# EAGLE design AW32_Demoboard_V11_DLN_18319 (EAGLE 5.11)

## Sheet 1 of 3
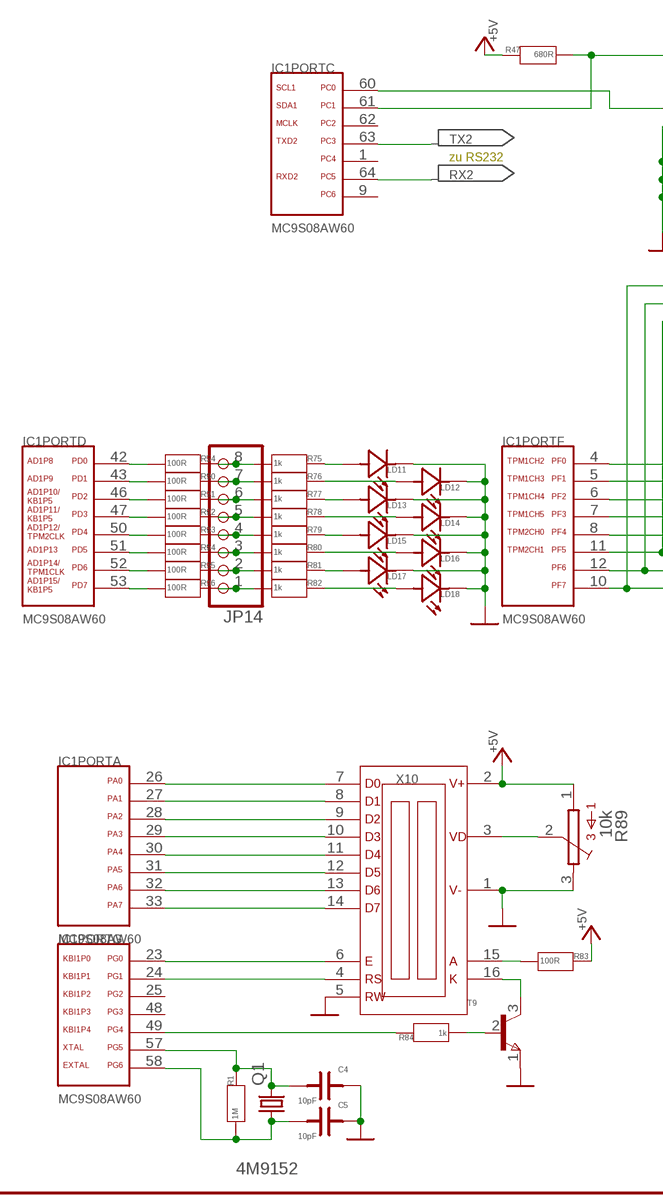
[diagram p0: schematic, sheet 1, part 1 of 2]
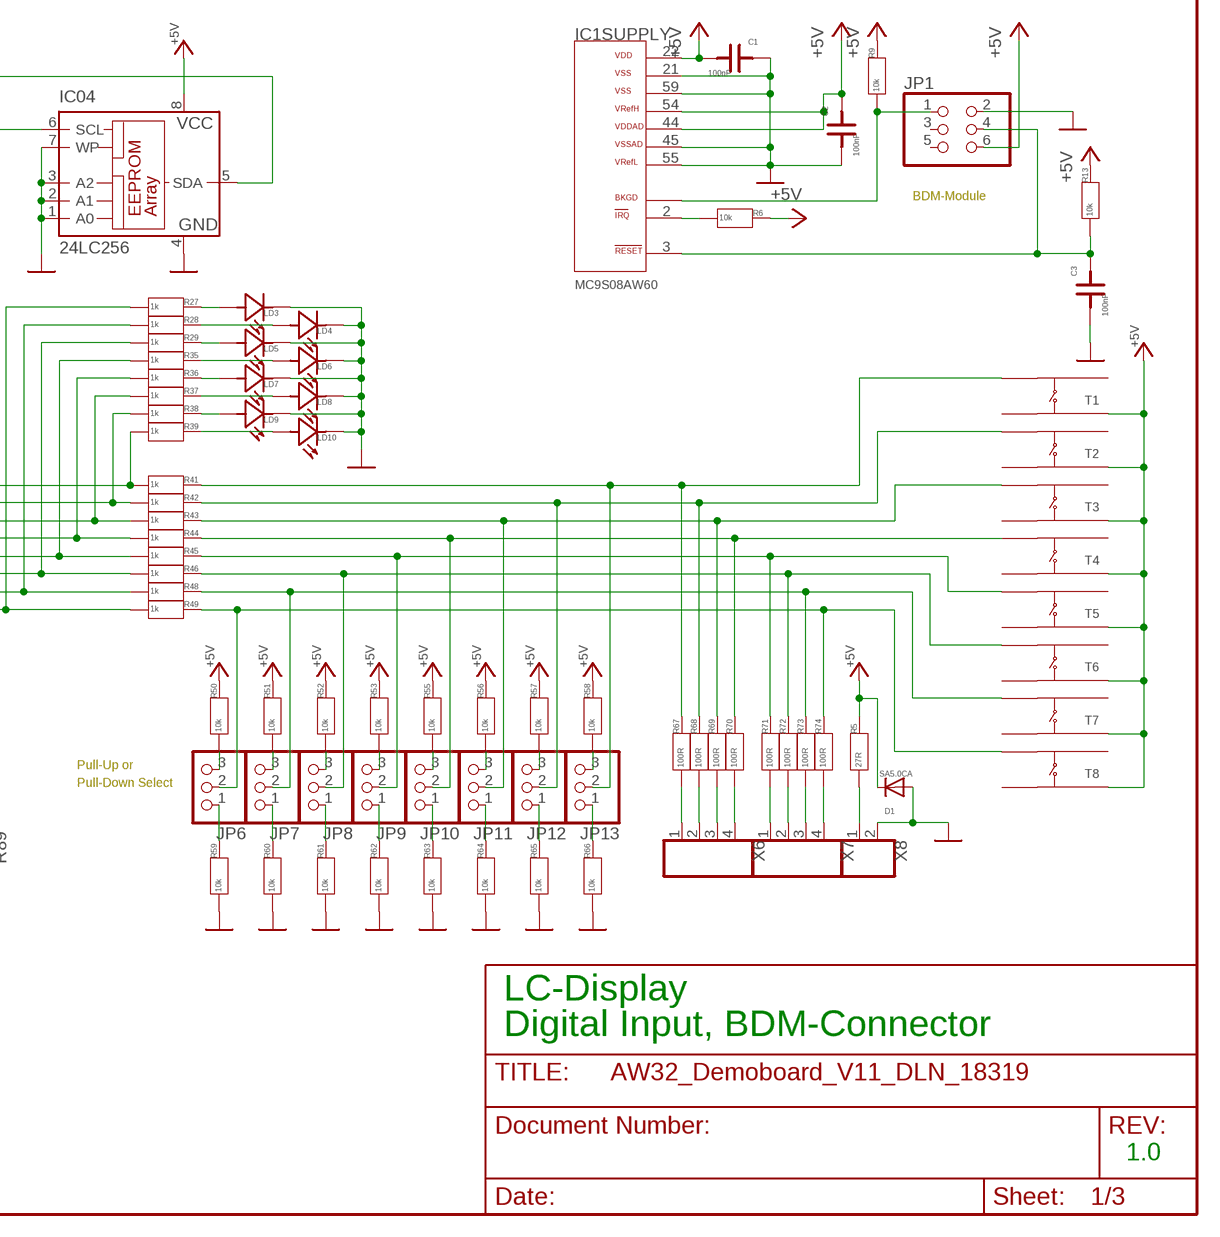
[diagram p1: schematic, sheet 1, part 2 of 2]

### Parts
C1  100nF  C1  [0805F]
C2  100nF  C1  [0805F]
C3  100nF  C1  [0805F]
C4  10pF  C1  [0805F]
C5  10pF  C1  [0805F]
D1  SA5.0CA  DIODE-SMB  [SMB]
IC1  MC9S08AW60  [LQFP64]
IC04  24LC256  24CLC256SM  [SO-08M]
JP1  PINHD-2X3  [2X03]
JP6  PINHD-1X3  [1X03]
JP7  PINHD-1X3  [1X03]
JP8  PINHD-1X3  [1X03]
JP9  PINHD-1X3  [1X03]
JP10  PINHD-1X3  [1X03]
JP11  PINHD-1X3  [1X03]
JP12  PINHD-1X3  [1X03]
JP13  PINHD-1X3  [1X03]
JP14  PINHD-1X8  [1X08]
LD3  LEDSMD  [0805LED]
LD4  LEDSMD  [0805LED]
LD5  LEDSMD  [0805LED]
LD6  LEDSMD  [0805LED]
LD7  LEDSMD  [0805LED]
LD8  LEDSMD  [0805LED]
LD9  LEDSMD  [0805LED]
LD10  LEDSMD  [0805LED]
LD11  LEDSMD  [0805LED]
LD12  LEDSMD  [0805LED]
LD13  LEDSMD  [0805LED]
LD14  LEDSMD  [0805LED]
LD15  LEDSMD  [0805LED]
LD16  LEDSMD  [0805LED]
LD17  LEDSMD  [0805LED]
LD18  LEDSMD  [0805LED]
Q1  4M9152  HC49UP  [HC49UP]
R1  1M  R1  [0805]
R5  27R  R1  [0805]
R6  10k  R1  [0805]
R9  10k  R1  [0805]
R13  10k  R1  [0805]
R27  1k  R1  [0805]
R28  1k  R1  [0805]
R29  1k  R1  [0805]
R35  1k  R1  [0805]
R36  1k  R1  [0805]
R37  1k  R1  [0805]
R38  1k  R1  [0805]
R39  1k  R1  [0805]
R41  1k  R1  [0805]
R42  1k  R1  [0805]
R43  1k  R1  [0805]
R44  1k  R1  [0805]
R45  1k  R1  [0805]
R46  1k  R1  [0805]
R47  680R  R1  [0805]
R48  1k  R1  [0805]
R49  1k  R1  [0805]
R50  10k  R1  [0805]
R51  10k  R1  [0805]
R52  10k  R1  [0805]
R53  10k  R1  [0805]
R54  100R  R1  [0805]
R55  10k  R1  [0805]
R56  10k  R1  [0805]
R57  10k  R1  [0805]
R58  10k  R1  [0805]
R59  10k  R1  [0805]
R60  10k  R1  [0805]
R61  10k  R1  [0805]
R62  10k  R1  [0805]
R63  10k  R1  [0805]
R64  10k  R1  [0805]
R65  10k  R1  [0805]
R66  10k  R1  [0805]
R67  100R  R1  [0805]
R68  100R  R1  [0805]
R69  100R  R1  [0805]
R70  100R  R1  [0805]
R71  100R  R1  [0805]
R72  100R  R1  [0805]
R73  100R  R1  [0805]
R74  100R  R1  [0805]
R75  1k  R1  [0805]
R76  1k  R1  [0805]
R77  1k  R1  [0805]
R78  1k  R1  [0805]
R79  1k  R1  [0805]
R80  1k  R1  [0805]
R81  1k  R1  [0805]
R82  1k  R1  [0805]
R83  100R  R1  [0805]
R84  1k  R1  [0805]
R89  10k  S63X  [S63X]
R90  100R  R1  [0805]
R91  100R  R1  [0805]
R92  100R  R1  [0805]
R93  100R  R1  [0805]
R94  100R  R1  [0805]
R95  100R  R1  [0805]
R96  100R  R1  [0805]
T1  TASTERTHT  [TASTE_THT]
T2  TASTERTHT  [TASTE_THT]
T3  TASTERTHT  [TASTE_THT]
T4  TASTERTHT  [TASTE_THT]
T5  TASTERTHT  [TASTE_THT]
T6  TASTERTHT  [TASTE_THT]
T7  TASTERTHT  [TASTE_THT]
T8  TASTERTHT  [TASTE_THT]
T9  BC817  [SOT-23]
X6  KLEMME4  [KLEMME4]
X7  KLEMME4  [KLEMME4]
X8  KLEMME2  [KLEMME2]
X10  FDCC1602E  [FDCC1602E]

### Nets
+5V: C1.1 C2.2 D1.C IC1.22(SUPPLY:VDD) IC1.44(SUPPLY:VDDAD) IC1.54(SUPPLY:VREFH) IC04.8(VCC) JP1.6 R5.2 R6.2 R9.2 R13.2 R47.2 R50.2 R51.2 R52.2 R53.2 R55.2 R56.2 R57.2 R58.2 R83.2 R89.1 T1.A1 T2.A1 T3.A1 T4.A1 T5.A1 T6.A1 T7.A1 T8.A1 X10.2(V+) ; also sheet 2,3
BKGD: IC1.56(SUPPLY:BKGD) JP1.1 R9.1
D0: IC1.26(PORTA:PA0) X10.7(D0)
D1: IC1.27(PORTA:PA1) X10.8(D1)
D2: IC1.28(PORTA:PA2) X10.9(D2)
D3: IC1.29(PORTA:PA3) X10.10(D3)
GND: C1.2 C2.1 C3.1 C4.2 C5.2 D1.A IC1.21(SUPPLY:VSS) IC1.45(SUPPLY:VSSAD) IC1.55(SUPPLY:VREFL) IC1.59(SUPPLY:VSS2) IC04.1(A0) IC04.2(A1) IC04.3(A2) IC04.4(GND) IC04.7(WP) JP1.2 LD3.K LD4.K LD5.K LD6.K LD7.K LD8.K LD9.K LD10.K LD11.K LD12.K LD13.K LD14.K LD15.K LD16.K LD17.K LD18.K R59.1 R60.1 R61.1 R62.1 R63.1 R64.1 R65.1 R66.1 R89.3 T9.1(E) X8.2 X10.1(V-) X10.5(RW) ; also sheet 2,3
IRQ: IC1.2(SUPPLY:IRQ/) R6.1
LCD_LED: IC1.49(PORTG:PG4) R84.2
N$4: IC1.42(PORTD:PD0) R54.1
N$8: IC1.43(PORTD:PD1) R90.1
N$9: IC1.46(PORTD:PD2) R91.1
N$10: IC1.47(PORTD:PD3) R92.1
N$11: JP13.3 R58.1
N$12: JP12.3 R57.1
N$13: JP11.2 R43.2 R69.2 T3.B2
N$14: LD11.A R75.2
N$15: LD12.A R76.2
N$16: C4.1 IC1.57(PORTG:PG5) Q1.2 R1.2
N$17: IC1.50(PORTD:PD4) R93.1
N$18: IC1.51(PORTD:PD5) R94.1
N$19: IC1.52(PORTD:PD6) R95.1
N$20: IC1.53(PORTD:PD7) R96.1
N$21: IC1.12(PORTF:PF6) R28.1 R48.1
N$22: C5.1 IC1.58(PORTG:PG6) Q1.1 R1.1
N$23: IC1.11(PORTF:PF5) R29.1 R46.1
N$24: LD3.A R27.2
N$25: LD4.A R28.2
N$26: LD5.A R29.2
N$27: LD6.A R35.2
N$29: LD7.A R36.2
N$31: LD8.A R37.2
N$32: LD9.A R38.2
N$33: LD10.A R39.2
N$34: JP11.3 R56.1
N$35: JP9.2 R45.2 R71.2 T5.B2
N$36: JP8.2 R46.2 R72.2 T6.B2
N$37: JP7.2 R48.2 R73.2 T7.B2
N$38: JP10.3 R55.1
N$39: JP9.3 R53.1
N$40: JP8.3 R52.1
N$41: JP7.3 R51.1
N$42: IC1.10(PORTF:PF7) R27.1 R49.1
N$43: R5.1 X8.1
N$44: IC1.4(PORTF:PF0) R39.1 R41.1
N$45: IC1.5(PORTF:PF1) R38.1 R42.1
N$46: IC1.6(PORTF:PF2) R37.1 R43.1
N$47: IC1.7(PORTF:PF3) R36.1 R44.1
N$48: IC1.8(PORTF:PF4) R35.1 R45.1
N$49: IC1.30(PORTA:PA4) X10.11(D4)
N$50: IC1.31(PORTA:PA5) X10.12(D5)
N$51: IC1.32(PORTA:PA6) X10.13(D6)
N$52: IC1.33(PORTA:PA7) X10.14(D7)
N$54: JP13.2 R41.2 R67.2 T1.B2
N$55: IC1.23(PORTG:PG0) X10.6(E)
N$56: JP12.2 R42.2 R68.2 T2.B2
N$57: JP6.3 R50.1
N$58: IC1.24(PORTG:PG1) X10.4(RS)
N$59: JP10.2 R44.2 R70.2 T4.B2
N$60: R89.2 X10.3(VD)
N$61: JP6.1 R59.2
N$62: JP7.1 R60.2
N$63: JP8.1 R61.2
N$64: JP9.1 R62.2
N$65: JP6.2 R49.2 R74.2 T8.B2
N$66: JP10.1 R63.2
N$67: JP11.1 R64.2
N$68: JP12.1 R65.2
N$69: JP13.1 R66.2
N$72: LD13.A R77.2
N$73: LD14.A R78.2
N$74: LD15.A R79.2
N$75: LD16.A R80.2
N$76: LD17.A R81.2
N$77: LD18.A R82.2
N$86: R83.1 X10.15(A)
N$87: T9.3(C) X10.16(K)
N$88: R84.1 T9.2(B)
PD0: JP14.8 R54.2 R75.1
PD1: JP14.7 R76.1 R90.2
PD2: JP14.6 R77.1 R91.2
PD3: JP14.5 R78.1 R92.2
PD4: JP14.4 R79.1 R93.2
PD5: JP14.3 R80.1 R94.2
PD6: JP14.2 R81.1 R95.2
PD7: JP14.1 R82.1 R96.2
PF0: R67.1 X6.1
PF1: R68.1 X6.2
PF2: R69.1 X6.3
PF3: R70.1 X6.4
PF4: R71.1 X7.1
PF5: R72.1 X7.2
PF6: R73.1 X7.3
PF7: R74.1 X7.4
RESET: C3.2 IC1.3(SUPPLY:RST/) JP1.4 R13.1
RX2: IC1.64(PORTC:PC5) ; also sheet 2
SCL: IC1.60(PORTC:PC0) IC04.6(SCL)
SDA: IC1.61(PORTC:PC1) IC04.5(SDA) R47.1
TX2: IC1.63(PORTC:PC3) ; also sheet 2
Unconnected: IC1.1(PORTC:PC4) IC1.9(PORTC:PC6) IC1.25(PORTG:PG2) IC1.48(PORTG:PG3) IC1.62(PORTC:PC2) JP1.3 JP1.5 T1.A2 T1.B1 T2.A2 T2.B1 T3.A2 T3.B1 T4.A2 T4.B1 T5.A2 T5.B1 T6.A2 T6.B1 T7.A2 T7.B1 T8.A2 T8.B1

### Notes on the sheet
- zu RS232
- BDM-Module
- Pull-Up or
- Pull-Down Select
- LC-Display
- Digital Input, BDM-Connector
- 1.0

## Sheet 2 of 3
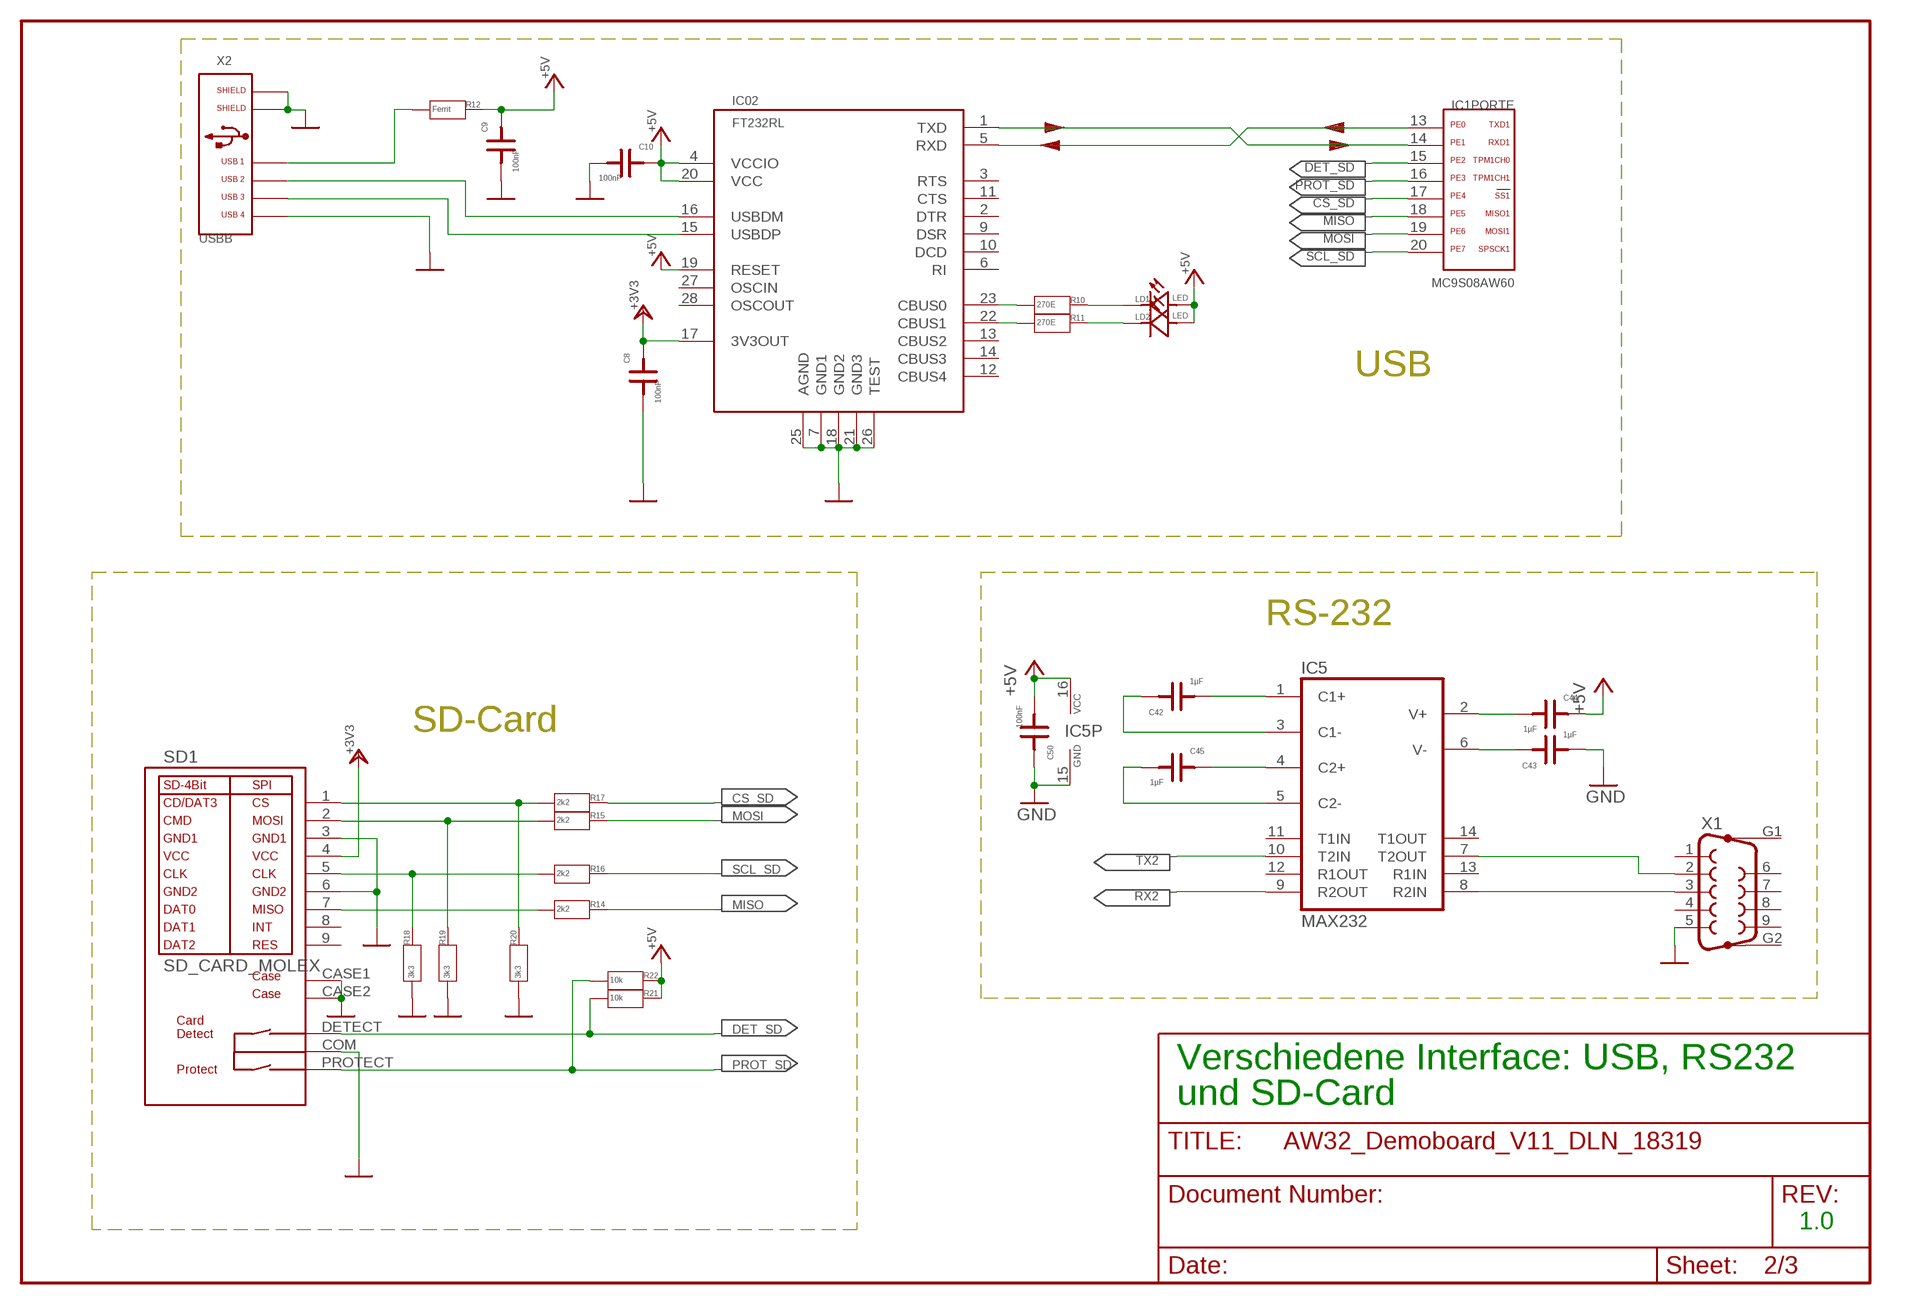
[diagram p2: schematic, sheet 2]

### Parts
C8  100nF  C1  [0805F]
C9  100nF  C1  [0805F]
C10  100nF  C1  [0805F]
C42  1µF  C1  [0805F]
C43  1µF  C1  [0805F]
C44  1µF  C1  [0805F]
C45  1µF  C1  [0805F]
C50  100nF  C1  [0805F]
IC02  FT232RL  FTDI232RL  [SSOP28]
IC5  MAX232  MAX232SO16  [SO16]
LD1  LED  LEDSMD  [0805LED]
LD2  LED  LEDSMD  [0805LED]
R10  270E  R1  [0805]
R11  270E  R1  [0805]
R12  Ferrit  R2  [1206]
R14  2k2  R1  [0805]
R15  2k2  R1  [0805]
R16  2k2  R1  [0805]
R17  2k2  R1  [0805]
R18  3k3  R1  [0805]
R19  3k3  R1  [0805]
R20  3k3  R1  [0805]
R21  10k  R1  [0805]
R22  10k  R1  [0805]
SD1  SD_CARD_MOLEX  [SD_CARD_MOLEX]
X1  F09HP  [F09HP]
X2  USBB  [USB_B]

### Nets
+3V3: C8.2 IC02.17(3V3OUT) SD1.4(VCC)
+5V: C9.2 C10.2 C44.2 C50.1 IC02.4(VCCIO) IC02.19(RESET) IC02.20(VCC) IC5.16(VCC) LD1.A LD2.A R12.2 R21.2 R22.2 ; also sheet 1,3
CS_SD: IC1.17(PORTE:PE4) R17.2
DATA1+: IC5.7(T2OUT) X1.2
DATA1-: IC5.8(R2IN) X1.3
DET_SD: IC1.15(PORTE:PE2) R21.1 SD1.DETECT
GND: C8.1 C9.1 C10.1 C43.1 C50.2 IC02.7(GND1) IC02.18(GND2) IC02.21(GND3) IC02.25(AGND) IC02.26(TEST) IC5.15(GND) R18.1 R19.1 R20.1 SD1.3(GND1) SD1.6(GND2) SD1.CASE1(FIX0) SD1.CASE2(FIX1) SD1.COM(COMMON) X1.5 X2.4 X2.S1 X2.S2 ; also sheet 1,3
MISO: IC1.18(PORTE:PE5) R14.2
MOSI: IC1.19(PORTE:PE6) R15.2
N$1: R15.1 R19.2 SD1.2(MOSI)
N$2: LD1.K R10.2
N$3: R14.1 SD1.7(MISO)
N$5: IC02.23(CBUS0) R10.1
N$6: LD2.K R11.2
N$7: IC02.22(CBUS1) R11.1
N$28: R16.1 R18.2 SD1.5(SCLK)
N$30: R17.1 R20.2 SD1.1(CS)
N$90: C42.1 IC5.1(C1+)
N$91: C42.2 IC5.3(C1-)
N$92: C45.2 IC5.4(C2+)
N$93: C45.1 IC5.5(C2-)
N$94: C44.1 IC5.2(V+)
N$95: C43.2 IC5.6(V-)
PROT_SD: IC1.16(PORTE:PE3) R22.1 SD1.PROTECT
RX1: IC1.14(PORTE:PE1) IC02.1(TXD)
RX2: IC5.9(R2OUT) ; also sheet 1
SCL_SD: IC1.20(PORTE:PE7) R16.2
TX1: IC1.13(PORTE:PE0) IC02.5(RXD)
TX2: IC5.10(T2IN) ; also sheet 1
USB_1: R12.1 X2.1
USB_2: IC02.16(USBDM) X2.2
USB_3: IC02.15(USBDP) X2.3
Unconnected: IC02.2(DTR) IC02.3(RTS) IC02.6(RI) IC02.9(DSR) IC02.10(DCD) IC02.11(CTS) IC02.12(CBUS4) IC02.13(CBUS2) IC02.14(CBUS3) IC02.27(OSCIN) IC02.28(OSCOUT) IC5.11(T1IN) IC5.12(R1OUT) IC5.13(R1IN) IC5.14(T1OUT) SD1.8(INT) SD1.9(RES) X1.1 X1.4 X1.6 X1.7 X1.8 X1.9 X1.G1 X1.G2

### Notes on the sheet
- USB
- RS-232
- SD-Card
- Verschiedene Interface: USB, RS232
- und SD-Card
- 1.0

## Sheet 3 of 3
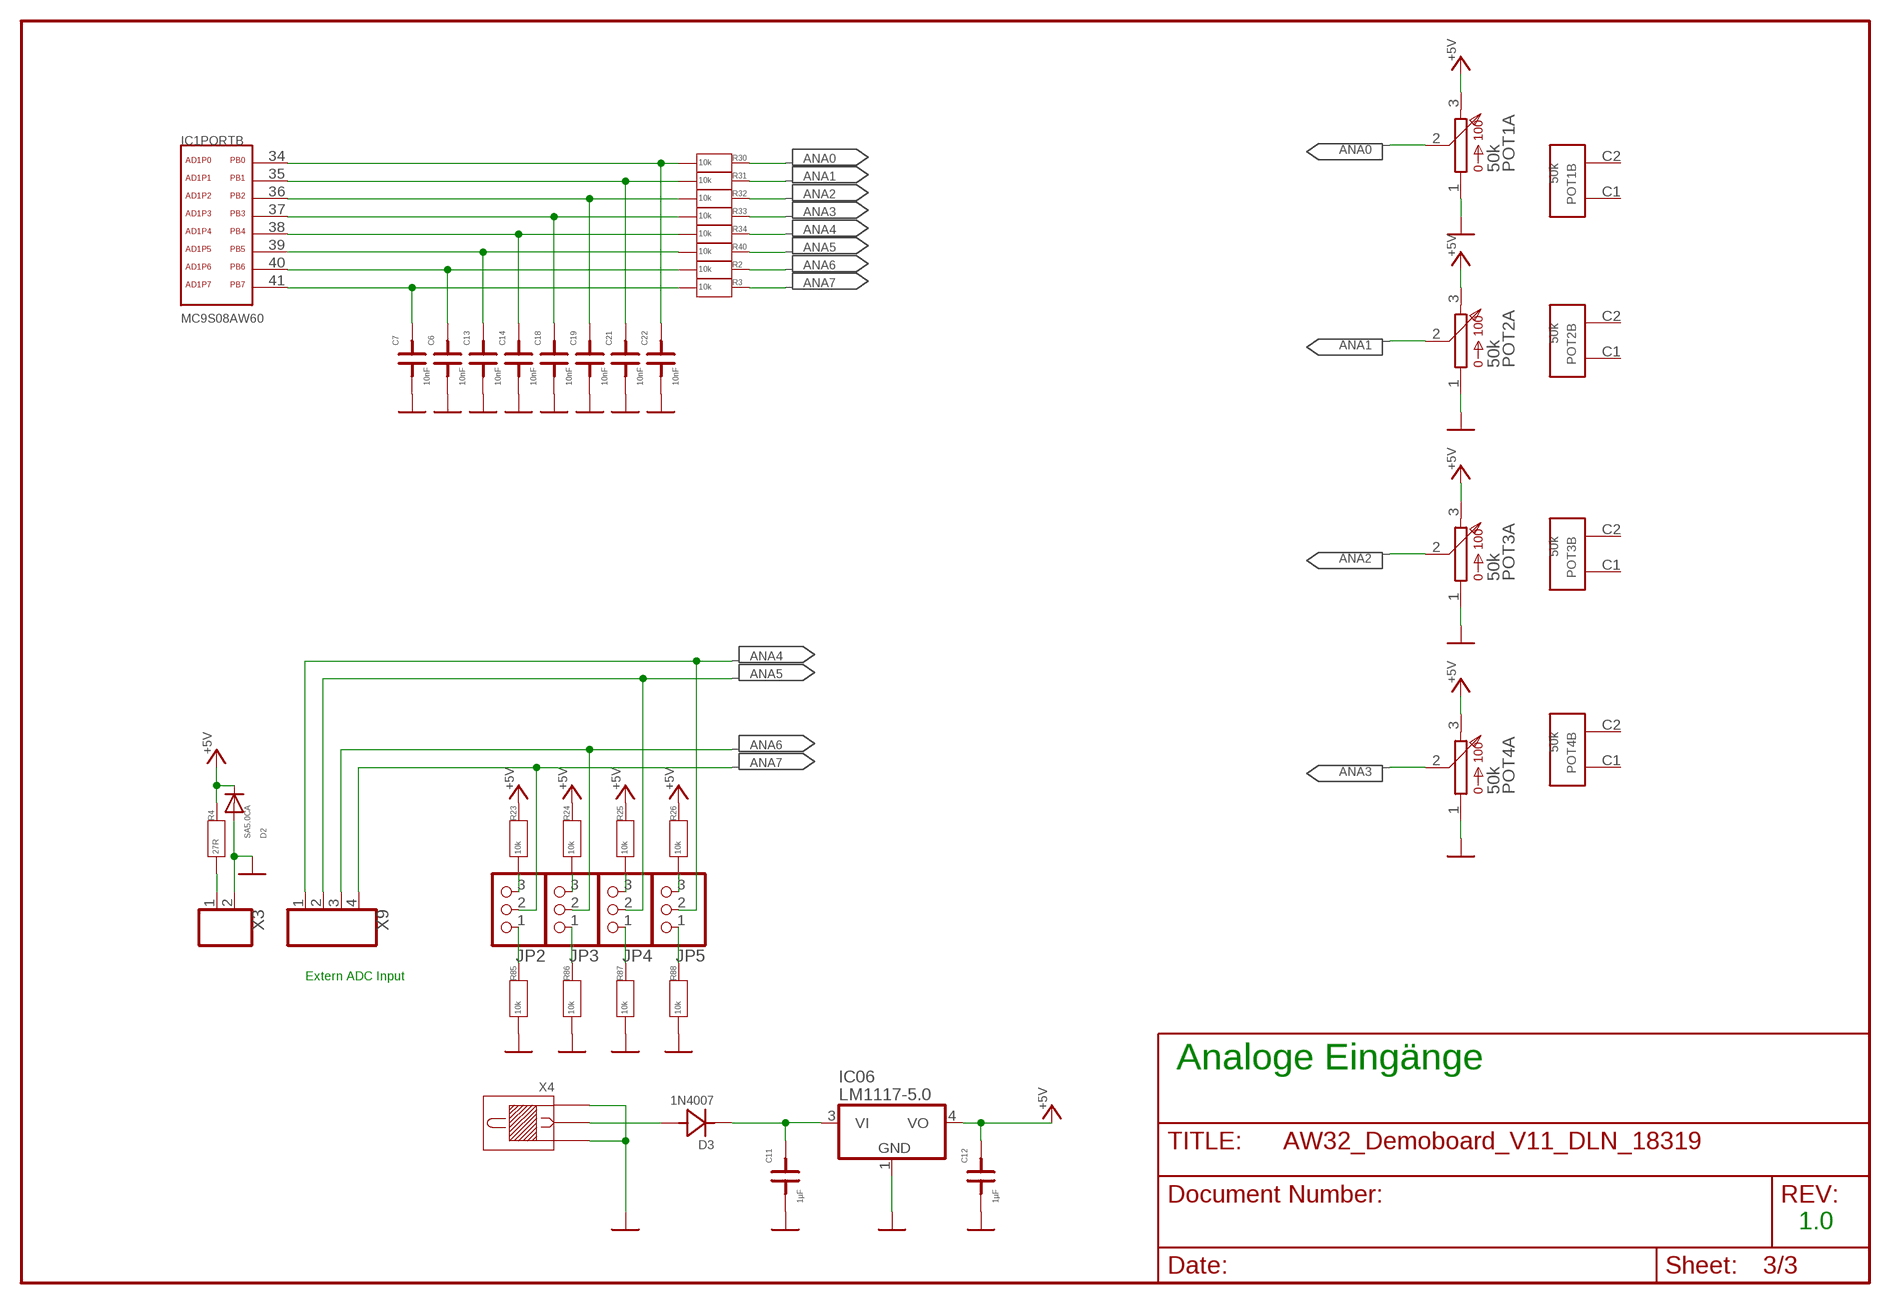
[diagram p3: schematic, sheet 3]

### Parts
C6  10nF  C1  [0805F]
C7  10nF  C1  [0805F]
C11  1µF  C1  [0805F]
C12  1µF  C1  [0805F]
C13  10nF  C1  [0805F]
C14  10nF  C1  [0805F]
C18  10nF  C1  [0805F]
C19  10nF  C1  [0805F]
C21  10nF  C1  [0805F]
C22  10nF  C1  [0805F]
D2  SA5.0CA  DIODE-SMB  [SMB]
D3  1N4007  DHCMELF  [MELF_B]
IC06  LM1117-5.0  LM1117DT  [DPAK]
JP2  PINHD-1X3  [1X03]
JP3  PINHD-1X3  [1X03]
JP4  PINHD-1X3  [1X03]
JP5  PINHD-1X3  [1X03]
POT1  50k  ALPSVERT  [ALPS_VERTICAL]
POT2  50k  ALPSVERT  [ALPS_VERTICAL]
POT3  50k  ALPSVERT  [ALPS_VERTICAL]
POT4  50k  ALPSVERT  [ALPS_VERTICAL]
R2  10k  R1  [0805]
R3  10k  R1  [0805]
R4  27R  R1  [0805]
R23  10k  R1  [0805]
R24  10k  R1  [0805]
R25  10k  R1  [0805]
R26  10k  R1  [0805]
R30  10k  R1  [0805]
R31  10k  R1  [0805]
R32  10k  R1  [0805]
R33  10k  R1  [0805]
R34  10k  R1  [0805]
R40  10k  R1  [0805]
R85  10k  R1  [0805]
R86  10k  R1  [0805]
R87  10k  R1  [0805]
R88  10k  R1  [0805]
X3  KLEMME2  [KLEMME2]
X4  SPP  [SPP]
X9  KLEMME4  [KLEMME4]

### Nets
+5V: C12.2 D2.C IC06.4(VO) POT1.3 POT2.3 POT3.3 POT4.3 R4.2 R23.2 R24.2 R25.2 R26.2 ; also sheet 1,2
ADCPB0: C22.2 IC1.34(PORTB:PB0) R30.1
ADCPB1: C21.2 IC1.35(PORTB:PB1) R31.1
ADCPB2: C19.2 IC1.36(PORTB:PB2) R32.1
ADCPB3: C18.2 IC1.37(PORTB:PB3) R33.1
ADCPB4: C14.2 IC1.38(PORTB:PB4) R34.1
ADCPB5: C13.2 IC1.39(PORTB:PB5) R40.1
ADCPB6: C6.2 IC1.40(PORTB:PB6) R2.1
ADCPB7: C7.2 IC1.41(PORTB:PB7) R3.1
ANA0: POT1.2 R30.2
ANA1: POT2.2 R31.2
ANA2: POT3.2 R32.2
ANA3: POT4.2 R33.2
ANA4: JP5.2 R34.2 X9.1
ANA5: JP4.2 R40.2 X9.2
ANA6: JP3.2 R2.2 X9.3
ANA7: JP2.2 R3.2 X9.4
GND: C6.1 C7.1 C11.1 C12.1 C13.1 C14.1 C18.1 C19.1 C21.1 C22.1 D2.A IC06.1(GND) POT1.1 POT2.1 POT3.1 POT4.1 R85.1 R86.1 R87.1 R88.1 X3.2 X4.1 X4.3 ; also sheet 1,2
N$53: R4.1 X3.1
N$70: C11.2 D3.K IC06.3(VI)
N$71: D3.A X4.2
N$89: JP5.3 R26.1
N$96: JP4.3 R25.1
N$97: JP3.3 R24.1
N$98: JP2.3 R23.1
N$99: JP2.1 R85.2
N$100: JP3.1 R86.2
N$101: JP4.1 R87.2
N$102: JP5.1 R88.2
Unconnected: POT1.C1(B:C1) POT1.C2(B:C2) POT2.C1(B:C1) POT2.C2(B:C2) POT3.C1(B:C1) POT3.C2(B:C2) POT4.C1(B:C1) POT4.C2(B:C2)

### Notes on the sheet
- Extern ADC Input
- Analoge Eingänge
- 1.0

## Library data of the parts
C1-C14 C18 C19 C21 C22 C42-C45 C50 = deto:C
D1 D2 = diode:DIODE-: DIODE
D3 = deto:DHC: Hii-Curr-Diode, Silizium, Typ Gleichrichter z.B. wie 1N4007 oder ähnlich
IC1 = MOTOROLA:MC9S08AW60
IC02 = deto2:FTDI232: FT232R USB zu RS232 Konverter von FTDI www.ftdichip.com
IC04 = microchip:24C*: Serial EEPROM 1 K/2 K/4 K
IC5 = maxim:MAX232: RS232 TRANSEIVER
IC06 = deto:LM1117: Spannungsregler Fix oder einstellbar LM1117XX-YY wobei XX die Gehäuseform angibt (DT = Dpak) und YY die Spannung angibt (z.B. 5.0 für 5V oder ADJ für einstellbar)
JP1 = pinhead:PINHD-2X3
JP2-JP13 = pinhead:PINHD-1X3
JP14 = pinhead:PINHD-1X8
LD1-LD18 = deto:LED: Led´s in allen Formen
POT1-POT4 = pot:ALPS
Q1 = crystal:HC49UP: CRYSTAL
R1-R6 R9-R88 R90-R96 = deto:R: Widerstand 400 mil - 0805 - 1206
R89 = pot:S63X: POTENTIOMETER
SD1 = CONNECT:SD_CARD_MOLEX: MOLEX SD-Card-Reader SD-54768-0977 SD-54768-0972 RS-Dest.Nr.: 487-9298
T1-T8 = deto:TASTER: Taste SMD, Typ DIPTRONICS DTSM-644K Distrelec-Best.Nr: 200312
T9 = deto:BC817
X1 = con-subd:F09HP: HARTING SUB-D
X2 = CONNECT:USB: USB-Stecker Typ a oder B, für PCB-Montage
X3 X8 = CONNECT:KLEMME2
X4 = CONNECT:SPP
X6 X7 X9 = CONNECT:KLEMME4
X10 = DISP-LCD:FDCC1602: LCD 2x16 Zeichen FDCC1602_x_FLYYBWJ Fordatata, wobei das "x" durch das Variant ersetzt wird! www.fordata.com

## Board
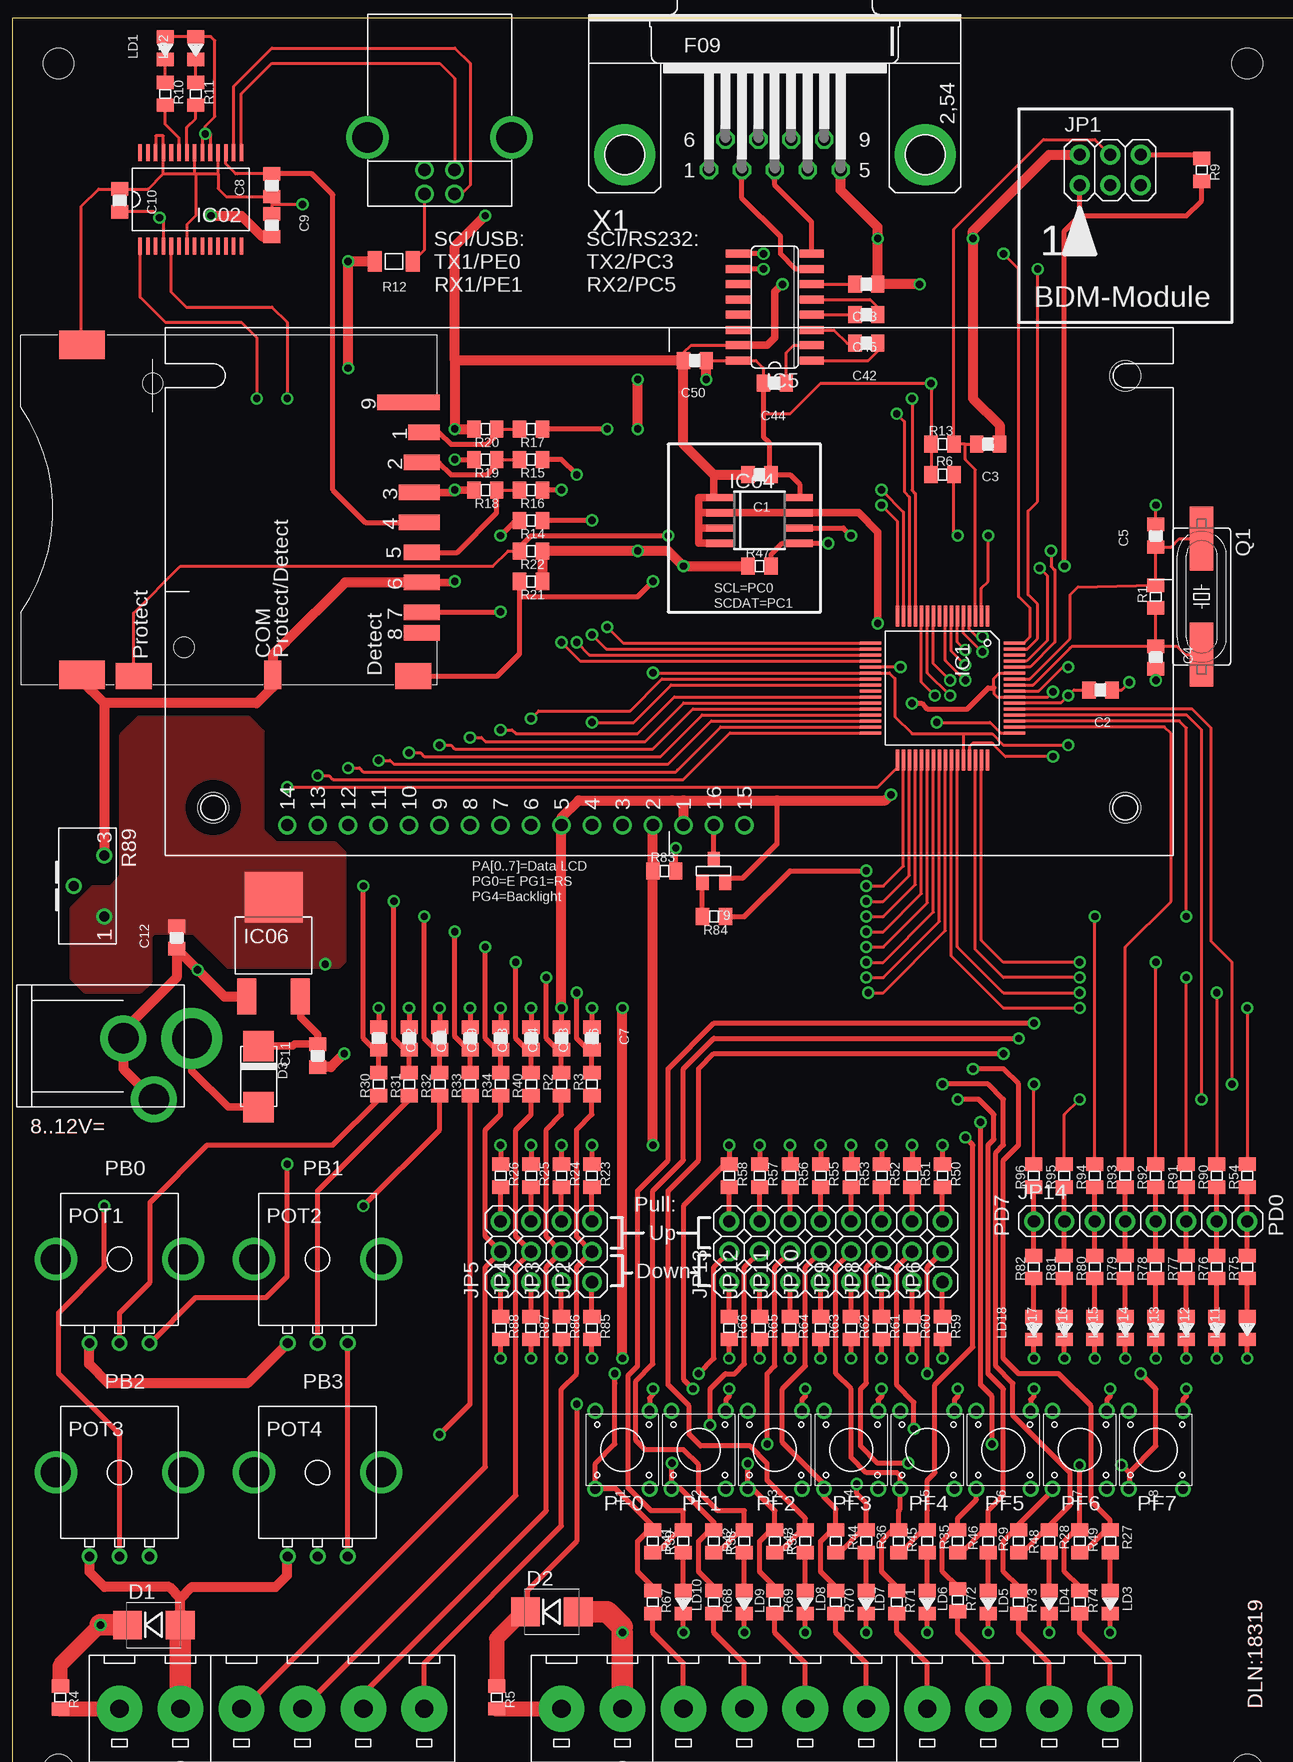
[diagram p4: board, top side]
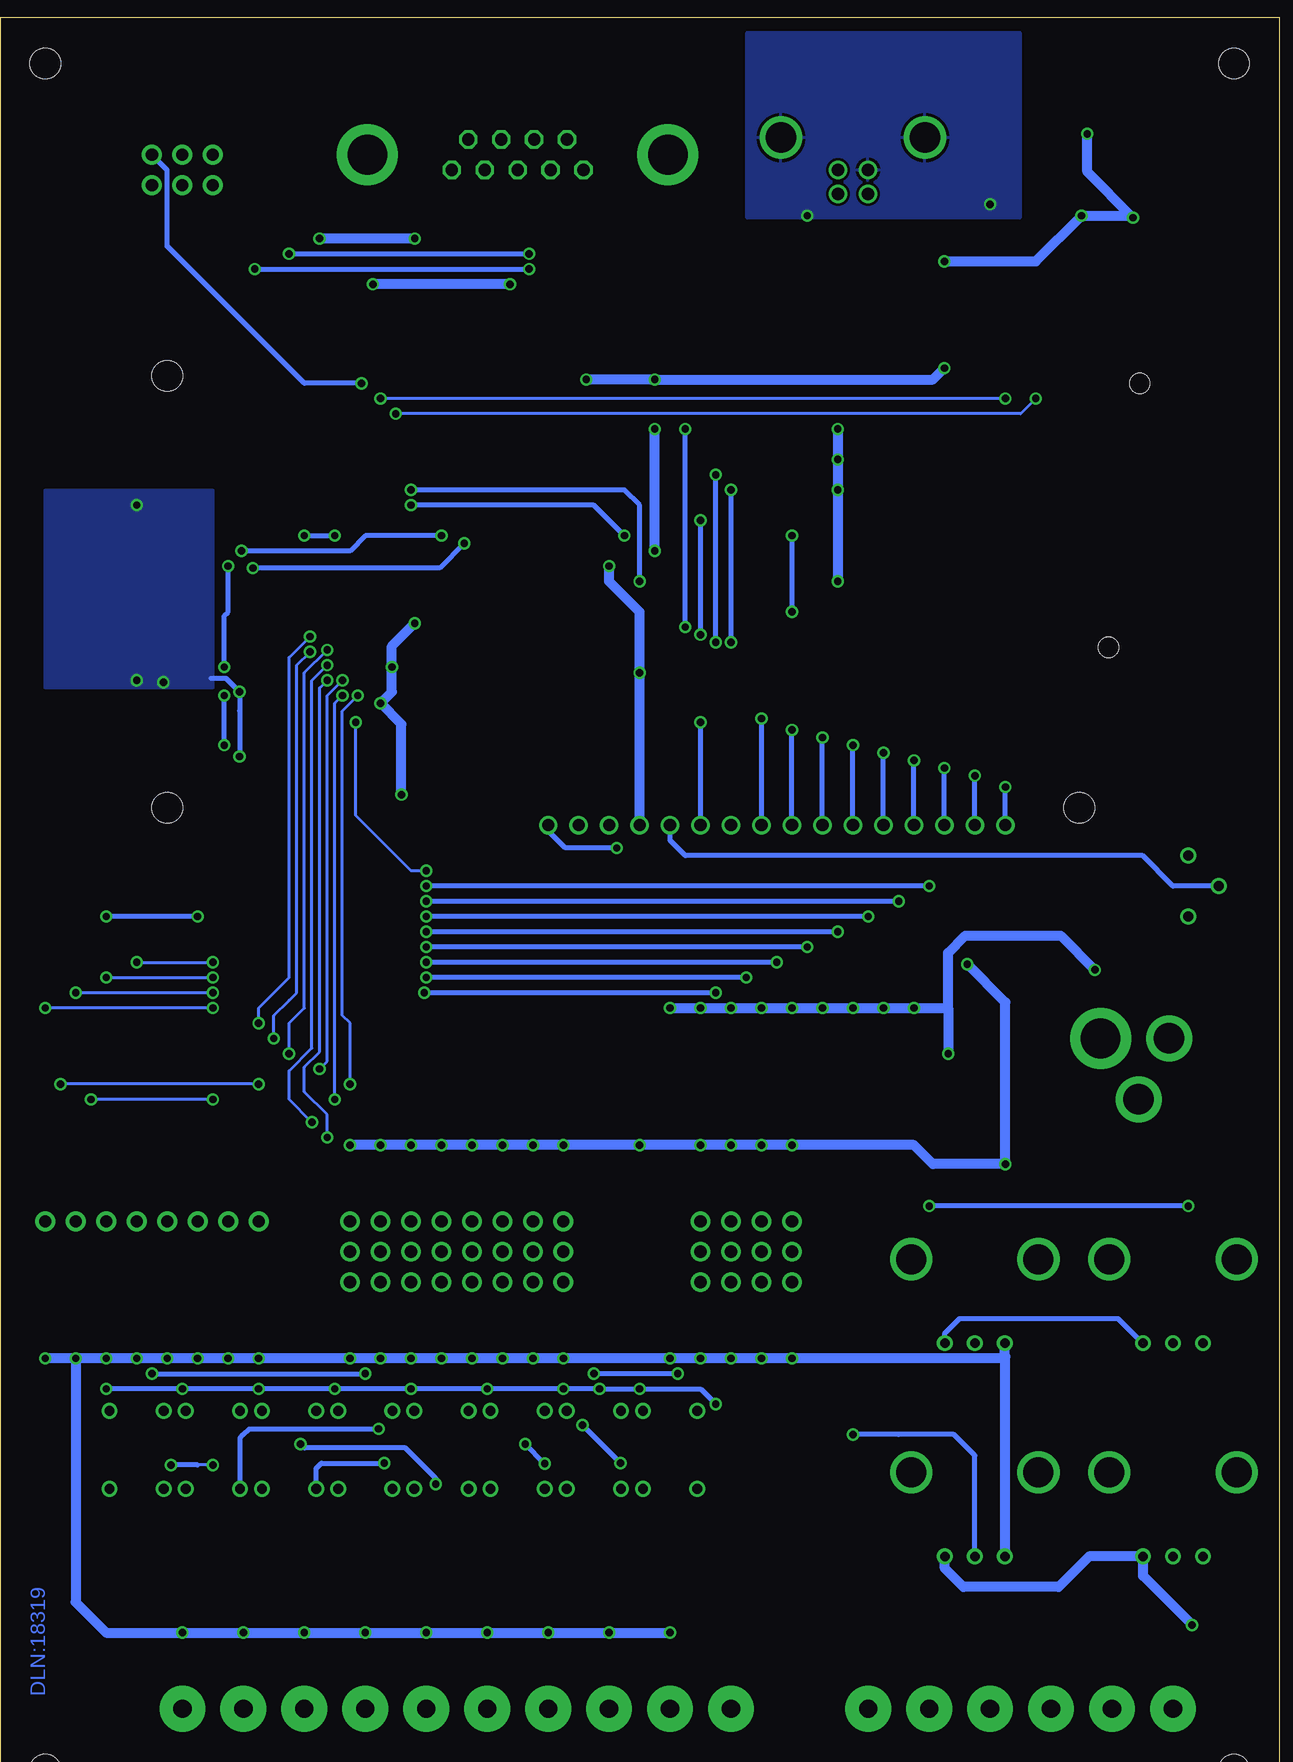
[diagram p5: board, bottom side, seen from below]

No outline drawn. Coordinates in mm, seen from the top.
Copper layers (1*16): Top 0.035mm / dielectric 1.5mm / Bottom 0.035mm
Design rules "default": minimum track width 10mil, minimum drill 24mil, track to track 8mil, track to pad 8mil, pad to pad 8mil, via to via 8mil, smd to smd 8mil, copper to edge 40mil, drill to drill 8mil, minimum pad ring 10mil, minimum via ring 8mil, stop-mask expansion 0mil, vias tented up to drill 0mil, thermal gap 10mil
Holes 2.54 mm at 4.92,146.05 103.98,146.05 103.98,3.81 4.92,3.81
Milling: 4 lines

### Footprints (pad centres in the part's own frame; a part is rotated, then mirrored left to right if it is on the bottom)
0805F = smd 1.118 x 1.422: 1 -0.953,0; 2 0.953,0
SMB = smd 2.4 x 2.4: A 2.2,0; C -2.2,0
MELF_B = smd 2.54 x 2.54: A 2.54,0; K -2.54,0
LQFP64 = smd 1.778 x 0.254: 1 -6,3.75; 2 -6,3.25; 3 -6,2.75; 4 -6,2.25; 5 -6,1.75; 6 -6,1.25; 7 -6,0.75; 8 -6,0.25; 9 -6,-0.25; 10 -6,-0.75; 11 -6,-1.25; 12 -6,-1.75; 13 -6,-2.25; 14 -6,-2.75; 15 -6,-3.25; 16 -6,-3.75; 33 6,-3.75; 34 6,-3.25; 35 6,-2.75; 36 6,-2.25; 37 6,-1.75; 38 6,-1.25; 39 6,-0.75; 40 6,-0.25; 41 6,0.25; 42 6,0.75; 43 6,1.25; 44 6,1.75; 45 6,2.25; 46 6,2.75; 47 6,3.25; 48 6,3.75 | smd 0.254 x 1.778: 17 -3.75,-6; 18 -3.25,-6; 19 -2.75,-6; 20 -2.25,-6; 21 -1.75,-6; 22 -1.25,-6; 23 -0.75,-6; 24 -0.25,-6; 25 0.25,-6; 26 0.75,-6; 27 1.25,-6; 28 1.75,-6; 29 2.25,-6; 30 2.75,-6; 31 3.25,-6; 32 3.75,-6; 49 3.75,6; 50 3.25,6; 51 2.75,6; 52 2.25,6; 53 1.75,6; 54 1.25,6; 55 0.75,6; 56 0.25,6; 57 -0.25,6; 58 -0.75,6; 59 -1.25,6; 60 -1.75,6; 61 -2.25,6; 62 -2.75,6; 63 -3.25,6; 64 -3.75,6
SSOP28 = smd 1.4 x 0.3: 1 0,8.45; 2 0,7.8; 3 0,7.15; 4 0,6.5; 5 0,5.85; 6 0,5.2; 7 0,4.55; 8 0,3.9; 9 0,3.25; 10 0,2.6; 11 0,1.95; 12 0,1.3; 13 0,0.65; 14 0,0; 15 7.8,0; 16 7.8,0.65; 17 7.8,1.3; 18 7.8,1.95; 19 7.8,2.6; 20 7.8,3.25; 21 7.8,3.9; 22 7.8,4.55; 23 7.8,5.2; 24 7.8,5.85; 25 7.8,6.5; 26 7.8,7.15; 27 7.8,7.8; 28 7.8,8.45
SO-08M = smd 0.6 x 2.2: 1 -1.905,-3.33; 2 -0.635,-3.33; 3 0.635,-3.33; 4 1.905,-3.33; 5 1.905,3.33; 6 0.635,3.33; 7 -0.635,3.33; 8 -1.905,3.33
SO16 = smd 0.66 x 2.032: 1 -4.445,-3.073; 2 -3.175,-3.073; 3 -1.905,-3.073; 4 -0.635,-3.073; 5 0.635,-3.073; 6 1.905,-3.073; 7 3.175,-3.073; 8 4.445,-3.073; 9 4.445,3.073; 10 3.175,3.073; 11 1.905,3.073; 12 0.635,3.073; 13 -0.635,3.073; 14 -1.905,3.073; 15 -3.175,3.073; 16 -4.445,3.073
DPAK = smd 1.6 x 2.997: 1 -2.261,-3.658; 3 2.21,-3.658 | smd 4.826 x 4.191: 4 0,4.623
2X03 = drill 1.016 pad 1.676 round: 1 -2.54,-1.27; 2 -2.54,1.27; 3 0,-1.27; 4 0,1.27; 5 2.54,-1.27; 6 2.54,1.27
1X03 = drill 1.016 pad 1.651 round: 1 -2.54,0; 2 0,0; 3 2.54,0
1X08 = drill 1.016 pad 1.651 round: 1 -8.89,0; 2 -6.35,0; 3 -3.81,0; 4 -1.27,0; 5 1.27,0; 6 3.81,0; 7 6.35,0; 8 8.89,0
0805LED = smd 1.118 x 1.422: A 0.953,0; K -0.953,0
ALPS_VERTICAL = drill 0.813 round: 1 -2.5,0; 2 0,0; 3 2.5,0 | drill 2.5 round: C1 -5.3,7; C2 5.3,7
HC49UP = smd 5.334 x 1.93: 1 -4.826,0; 2 4.826,0
0805 = smd 1.118 x 1.422: 1 -0.953,0; 2 0.953,0
1206 = smd 1.168 x 1.727: 1 -1.587,0; 2 1.587,0
S63X = drill 0.813 round: 1 2.54,0; 2 0,-2.54; 3 -2.54,0
SD_CARD_MOLEX = smd 1.3 x 2.6: 1 -4.1,1.3 | smd 1.3 x 3: 2 -6.6,1.5; 5 -14.1,1.5; 6 -16.6,1.5; 7 -19.1,1.5; 8 -20.8,1.5 | smd 1.3 x 3.4: 3 -9.1,1.7; 4 -11.6,1.7 | smd 1.3 x 5.2: 9 -1.6,2.6 | smd 2.4 x 3.8: CASE1 -24.3,29.8; CASE2 3.2,29.8 | smd 2.4 x 1.4: COM -24.3,13.9 | smd 2.2 x 3: DETECT -24.4,2.2; PROTECT -24.4,25.5 | hole 1.676: 0,23.9; -22,21.3
TASTE_THT = drill 0.813 round: A1 -3.251,2.261; A2 3.251,2.261; B1 -3.251,-2.261; B2 3.251,-2.261
SOT-23 = smd 1.016 x 1.27: 1 -0.953,0.953; 2 0.953,0.953; 3 0,-0.953
F09HP = drill 1.016 octagon: 1 -5.486,-1.27; 2 -2.743,-1.27; 3 0,-1.27; 4 2.743,-1.27; 5 5.486,-1.27; 6 -4.115,1.27; 7 -1.372,1.27; 8 1.372,1.27; 9 4.115,1.27 | drill 3.302 pad 5.08 round: G1 -12.522,0; G2 12.522,0
USB_B = drill 1.016 round: 1 1.25,2; 2 -1.25,2; 3 -1.25,0; 4 1.25,0 | drill 2.54 round: S1 -6,-2.7; S2 6,-2.7
KLEMME2 = drill 1.524 pad 3.81 round: 1 0,-2.54; 2 0,2.54
SPP = drill 2.54 pad 3.81 round: 1 0,0; 3 -2.54,5.08 | drill 3.302 pad 5.08 round: 2 -5.715,0
KLEMME4 = drill 1.524 pad 3.81 round: 1 0,-7.62; 2 0,-2.54; 3 0,2.54; 4 0,7.62
FDCC1602E = drill 1.016 round: 1 43.18,2.54; 2 40.64,2.54; 3 38.1,2.54; 4 35.56,2.54; 5 33.02,2.54; 6 30.48,2.54; 7 27.94,2.54; 8 25.4,2.54; 9 22.86,2.54; 10 20.32,2.54; 11 17.78,2.54; 12 15.24,2.54; 13 12.7,2.54; 14 10.16,2.54; 15 48.26,2.54; 16 45.72,2.54 | hole 2.54: 4,4; 80,4; 80,40

### Placement (x,y rotation side)
C1  63.34,111.76 180 top
C2  91.76,93.82 180 top
C3  82.39,114.3 180 top
C4  96.36,96.52 270 top
C5  96.36,106.68 90 top
C6  46.83,64.77 270 top
C7  49.37,64.77 270 top
C8  22.7,135.89 90 top
C9  22.7,132.56 270 top
C10  10,134.62 270 top
C11  26.51,63.34 90 top
C12  14.76,73.18 90 top
C13  44.29,64.77 270 top
C14  41.75,64.77 270 top
C18  39.21,64.77 270 top
C19  36.67,64.77 270 top
C21  34.13,64.77 270 top
C22  31.59,64.77 270 top
C42  72.23,122.71 180 top
C43  72.23,127.64 180 top
C44  64.61,119.38 180 top
C45  72.23,125.09 180 top
C50  57.94,121.28 180 top
D1  12.86,15.88 0 top
D2  46.04,16.99 0 top
D3  21.59,61.59 270 top
IC1  78.58,93.98 270 top
IC02  20.16,130.81 90 top
IC04  63.34,107.95 270 top
IC5  64.61,125.73 90 top
IC06  22.86,71.91 0 top
JP1  92.55,137.16 0 top
JP2  49.37,46.99 90 top
JP3  46.83,46.99 90 top
JP4  44.29,46.99 90 top
JP5  41.75,46.99 90 top
JP6  78.58,46.99 90 top
JP7  76.04,46.99 90 top
JP8  73.5,46.99 90 top
JP9  70.96,46.99 90 top
JP10  68.42,46.99 90 top
JP11  65.88,46.99 90 top
JP12  63.34,46.99 90 top
JP13  60.8,46.99 90 top
JP14  95.09,49.53 0 top
LD1  13.81,147.32 90 top
LD2  16.35,147.32 90 top
LD3  92.55,17.78 90 top
LD4  87.47,17.78 90 top
LD5  82.39,17.78 90 top
LD6  77.31,17.78 90 top
LD7  72.23,17.78 90 top
LD8  67.15,17.78 90 top
LD9  62.07,17.78 90 top
LD10  56.99,17.78 90 top
LD11  103.98,40.64 90 top
LD12  101.44,40.64 90 top
LD13  98.9,40.64 90 top
LD14  96.36,40.64 90 top
LD15  93.82,40.64 90 top
LD16  91.28,40.64 90 top
LD17  88.74,40.64 90 top
LD18  86.2,40.64 90 top
POT1  10,39.37 0 top
POT2  26.51,39.37 0 top
POT3  10,21.59 0 top
POT4  26.51,21.59 0 top
Q1  100.17,101.6 270 top
R1  96.36,101.6 270 top
R2  46.83,60.96 270 top
R3  49.37,60.96 270 top
R4  5.08,9.84 90 top
R5  41.43,9.84 90 top
R6  78.58,111.76 180 top
R9  100.17,137.16 90 top
R10  13.81,143.51 90 top
R11  16.35,143.51 90 top
R12  32.86,129.54 180 top
R13  78.58,114.3 180 top
R14  44.29,107.95 0 top
R15  44.29,113.03 0 top
R16  44.29,110.49 0 top
R17  44.29,115.57 0 top
R18  40.48,110.49 0 top
R19  40.48,113.03 0 top
R20  40.48,115.57 0 top
R21  44.29,102.87 0 top
R22  44.29,105.41 0 top
R23  49.37,53.34 90 top
R24  46.83,53.34 90 top
R25  44.29,53.34 90 top
R26  41.75,53.34 90 top
R27  92.55,22.86 270 top
R28  87.47,22.86 270 top
R29  82.39,22.86 270 top
R30  31.59,60.96 270 top
R31  34.13,60.96 270 top
R32  36.67,60.96 270 top
R33  39.21,60.96 270 top
R34  41.75,60.96 270 top
R35  77.31,22.86 270 top
R36  72.23,22.86 270 top
R37  67.15,22.86 270 top
R38  62.07,22.86 270 top
R39  56.99,22.86 270 top
R40  44.29,60.96 270 top
R41  54.45,22.86 90 top
R42  59.53,22.86 90 top
R43  64.61,22.86 90 top
R44  69.69,22.86 90 top
R45  74.93,22.86 90 top
R46  79.85,22.86 90 top
R47  63.34,104.14 180 top
R48  84.93,22.86 90 top
R49  90.01,22.86 90 top
R50  78.58,53.34 90 top
R51  76.04,53.34 90 top
R52  73.5,53.34 90 top
R53  70.96,53.34 90 top
R54  103.98,53.34 270 top
R55  68.42,53.34 90 top
R56  65.88,53.34 90 top
R57  63.34,53.34 90 top
R58  60.8,53.34 90 top
R59  78.58,40.64 90 top
R60  76.04,40.64 90 top
R61  73.5,40.64 90 top
R62  70.96,40.64 90 top
R63  68.42,40.64 90 top
R64  65.88,40.64 90 top
R65  63.34,40.64 90 top
R66  60.8,40.64 90 top
R67  54.45,17.78 90 top
R68  59.53,17.78 90 top
R69  64.61,17.78 90 top
R70  69.69,17.78 90 top
R71  74.77,17.78 90 top
R72  79.85,17.94 90 top
R73  84.93,17.78 90 top
R74  90.01,17.78 90 top
R75  103.98,45.72 270 top
R76  101.44,45.72 270 top
R77  98.9,45.72 270 top
R78  96.36,45.72 270 top
R79  93.82,45.72 270 top
R80  91.28,45.72 270 top
R81  88.74,45.72 270 top
R82  86.2,45.72 270 top
R83  55.4,78.74 180 top
R84  59.53,74.93 0 top
R85  49.37,40.64 90 top
R86  46.83,40.64 90 top
R87  44.29,40.64 90 top
R88  41.75,40.64 90 top
R89  8.73,77.47 270 top
R90  101.44,53.34 270 top
R91  98.9,53.34 270 top
R92  96.36,53.34 270 top
R93  93.82,53.34 270 top
R94  91.28,53.34 270 top
R95  88.74,53.34 270 top
R96  86.2,53.34 270 top
SD1  36.67,119.38 90 top
T1  51.91,30.48 270 top
T2  58.26,30.48 270 top
T3  64.61,30.48 270 top
T4  70.96,30.48 270 top
T5  77.31,30.48 270 top
T6  83.66,30.48 270 top
T7  90.01,30.48 270 top
T8  96.36,30.48 270 top
T9  59.53,78.74 180 top
X1  64.61,138.43 0 top
X2  36.67,137.16 180 top
X3  12.54,8.89 270 top
X4  10.32,64.77 180 top
X6  64.61,8.89 270 top
X7  84.93,8.89 270 top
X8  49.37,8.89 270 top
X9  27.78,8.89 270 top
X10  13.81,80.01 0 top

### Tracks (layer width: path | path; a pad name or v marks a point on that pad's centre or on a via)
+3V3
  Top 0.254: IC02.17 18.86,137.67 19.68,136.84 19.84,136.84 C8.2
  Top 0.406: SD1.4 30.49,107.78 27.78,110.49 27.78,135.1 26.04,136.84 C8.2 | C8.2
+5V  (via drill 0.61)  (1 unrouted)
  Top 0.254: IC1.54 88.44,92.73 v89.06,93.34 89.53,93.82 C2.2 | 61.59,121.28 | 61.59,121.28 IC5.16 63.02,121.28 63.66,120.65 63.66,119.54 | C50.1 61.59,121.28 | 61.59,121.28 | 63.66,119.54 | 63.66,119.54 C44.2 | LD2.A | LD2.A | LD2.A LD1.A | LD2.A | LD2.A 17.62,148.27 17.94,147.96 17.94,141.6 17.14,140.81 v17.14,140.18 | IC02.20 16.91,140.18 v17.14,140.18 | IC02.19 17.56,140.18 v17.14,140.18 | C10.2 12.86,133.67 v13.34,133.19 | IC02.4 13.66,132.87 v13.34,133.19 | v13.34,133.19 | v13.34,133.19 | 64.14,111.76 C1.1 | IC1.44 80.33,89.7 80.33,90.17 | 80.33,90.17 82.71,90.17 83.66,89.22 v89.06,89.22 | R6.2 | R6.2 R13.2 v77.63,119.38 68.42,119.38 65.88,116.84 63.66,116.84 | v54.45,95.25 54.47,95.23 IC1.22 74.16,95.23 74.61,94.77 74.61,91.6 76.04,90.17 80.17,90.17 80.33,90.17
  Top 0.406: v41.75,55.88 R26.2 | v44.29,55.88 R25.2 | v46.83,55.88 R24.2 | v49.37,55.88 R23.2 | v60.8,55.88 R58.2 60.48,54.29 56.99,50.8 56.99,36.35 v57.78,35.56 | v63.34,55.88 63.34,55.72 R57.2 | v65.88,55.88 R56.2 | v68.42,55.88 R55.2 | v70.96,55.88 R53.2 | v73.5,55.88 R52.2 | v76.04,55.88 R51.2 | v78.58,55.88 R50.2 | R83.2 | R83.2 | R83.2 | T1.A1 54.17,34.8 54.45,35.08 v54.45,35.56 | v60.8,35.56 60.8,34.92 60.52,34.65 T2.A1 | T3.A1 66.87,34.65 67.15,34.92 v67.15,35.56 | T4.A1 73.22,34.65 73.5,34.92 v73.5,35.56 | T5.A1 79.57,34.65 79.85,34.92 v79.85,35.56 | T6.A1 85.92,34.65 86.2,34.92 v86.2,35.56 | T7.A1 92.27,34.65 92.55,34.92 v92.55,35.56 | T8.A1 98.62,34.65 98.9,34.92 v98.9,35.56 | v48.1,34.29 48.1,22.86 43.97,18.73 43.97,17.3 43.84,17.12 | IC04.8 66.67,110.97 65.88,111.76 64.14,111.76 | R9.2 | JP1.6 99.85,138.43 R9.2 | 64.14,111.76 | 64.14,111.76 64.14,114.46 63.66,114.94 63.66,116.84 | R22.2 45.24,105.57 | 45.24,105.57 | C44.2 63.66,116.84 | 63.66,116.84 | 63.66,116.84 | R22.2 | 43.84,17.12 43.81,17.14 | 43.84,17.12 D2.C | POT4.3 29.05,21.59 29.01,21.63 POT2.3 | v23.97,54.29 23.97,44.93 22.23,43.18 16.35,43.18 12.54,39.37 | 12.54,39.37 | POT1.3 12.54,39.37 | v54.45,55.88 | v29.05,129.54 | v53.18,105.41
  Top 0.813: X10.2 R83.2 v54.45,55.88 | C9.2 21.91,131.6 20.16,133.35 v17.62,133.35 | R12.2 v29.05,129.54 v29.05,120.65 | v58.9,119.7 C50.1 | 45.24,105.57 R21.2 | R47.2 v56.99,104.14 55.72,105.41 v53.18,105.41 R22.2 | v53.18,115.57 v53.18,119.7
  Top 1.27: R5.2 41.43,14.76 43.81,17.14 | R4.2 5.08,12.54 v8.41,15.88
  Top 1.778: v8.41,15.88 D1.C
  Bottom 0.254: 13.49,133.35 v13.34,133.19
  Bottom 0.406: v98.9,35.56 v92.55,35.56 v86.2,35.56 v79.85,35.56 v73.5,35.56 v67.15,35.56 v60.8,35.56 v57.78,35.56 v54.45,35.56 49.37,35.56 v48.1,34.29 | v89.06,89.22 v89.06,93.34 | v77.63,119.38 82.39,119.38 93.82,130.81 93.82,137.16 94.61,137.95 | v54.45,95.25 | v54.45,95.25 | 94.61,137.95 | JP1.6 | 94.61,137.95 JP1.6 | POT2.3 29.01,40.2 27.78,41.43 14.61,41.43 12.54,39.37
  Bottom 0.813: v78.58,55.88 v76.04,55.88 v73.5,55.88 v70.96,55.88 v68.42,55.88 v65.88,55.88 v63.34,55.88 v60.8,55.88 v54.45,55.88 v49.37,55.88 v46.83,55.88 v44.29,55.88 v41.75,55.88 31.59,55.88 30,54.29 v23.97,54.29 23.97,67.79 v27.15,70.96 | v13.34,133.19 17.14,137 v17.14,140.18 | 13.49,133.35 v17.62,133.35 21.43,129.54 v29.05,129.54 | v58.9,119.7 v53.18,119.7 30,119.7 v29.05,120.65 | v56.99,104.14 56.99,103.35 56.99,102.87 54.45,100.33 v54.45,95.25 X10.2 | v53.18,105.41 v53.18,115.57 | v8.41,15.88 12.5,19.96 POT3.3 16.99,21.59 19.53,19.05 27.46,19.05 29.01,20.6 POT4.3
  pour Top (no thermals): 10.16,90.01 10.16,78.26 9.21,77.31 7.78,77.31 6.03,75.56 6.03,69.85 7.14,68.74 11.75,68.74 12.54,69.53 12.54,73.34 12.86,73.66 16.19,73.66 19.05,70.8 28.26,70.8 28.73,71.28 28.73,80.17 27.94,80.96 23.02,80.96 21.91,82.07 21.91,90.33 20.8,91.44 11.59,91.44
ADCPB0  (via drill 0.61)
  Top 0.254: IC1.34 75.33,79.14 73.66,77.47 v72.23,77.47
  Top 0.406: R30.1 | R30.1 C22.2 31.27,63.82 30.32,64.77 v30.32,77.47 | R30.1
  Bottom 0.406: v30.32,77.47 v72.23,77.47
ADCPB1  (via drill 0.61)
  Top 0.254: IC1.35 75.83,78.37 73.66,76.2 v72.23,76.2
  Top 0.406: 34.13,63.98 | 34.13,63.98 C21.2 | R31.1 34.13,63.98 | 34.13,63.98 | 34.13,63.98 33.66,63.98 32.86,64.77 v32.86,76.2
  Bottom 0.406: v32.86,76.2 v72.23,76.2
ADCPB2  (via drill 0.61)
  Top 0.254: IC1.36 76.33,77.6 73.66,74.93 v72.23,74.93
  Top 0.406: C19.2 36.35,63.82 35.4,64.77 v35.4,74.93 | v35.4,74.93 | C19.2 | R32.1 C19.2
  Bottom 0.406: v35.4,74.93 v72.23,74.93
ADCPB3  (via drill 0.61)
  Top 0.254: IC1.37 76.83,76.83 73.66,73.66 v72.23,73.66
  Top 0.406: C18.2 | R33.1 C18.2 | C18.2 39.05,63.82 37.94,64.93 v37.94,73.66
  Bottom 0.406: v37.94,73.66 v72.23,73.66
ADCPB4  (via drill 0.61)
  Top 0.254: IC1.38 77.33,76.06 73.66,72.39 v72.23,72.39
  Top 0.406: R34.1 C14.2 41.43,63.82 40.48,64.77 v40.48,72.39
  Bottom 0.406: v40.48,72.39 v72.23,72.39
ADCPB5  (via drill 0.61)
  Top 0.254: IC1.39 77.83,75.29 73.66,71.12 v72.23,71.12
  Top 0.406: R40.1 C13.2 43.97,63.82 43.02,64.77 v43.02,71.12
  Bottom 0.406: v43.02,71.12 v72.23,71.12
ADCPB6  (via drill 0.61)
  Top 0.254: IC1.40 78.33,74.52 73.66,69.85 v72.23,69.85
  Top 0.406: 46.83,63.66 C6.2 46.51,63.82 45.56,64.77 v45.56,69.85 | R2.1 46.83,63.66 | 46.83,63.66
  Bottom 0.406: v45.56,69.85 v72.23,69.85
ADCPB7  (via drill 0.61)
  Top 0.254: IC1.41 78.83,73.75 73.66,68.58 v72.39,68.58
  Top 0.406: 49.37,63.66 | 49.37,63.66 C7.2 49.05,63.82 48.1,64.77 v48.1,68.58 | R3.1 49.37,63.66 | 49.37,63.66
  Bottom 0.406: v48.1,68.58 v72.39,68.58
ANA0
  Top 0.406: R30.2 31.59,59.69 27.78,55.88 17.3,55.88 12.54,51.12 12.54,44.45 10,41.91 POT1.2
ANA1
  Top 0.406: R31.2 34.13,59.69 26.51,52.07 POT2.2
ANA2  (via drill 0.61)
  Top 0.406: R32.2 36.67,57.15 v30.32,50.8 | v30.32,50.8 | v8.73,50.8 8.73,45.72 4.92,41.91 4.92,36.83 10,31.75 POT3.2
  Bottom 0.406: v8.73,50.8 v30.32,50.8
ANA3  (via drill 0.61)
  Top 0.406: R33.2 39.21,34.29 v36.67,31.75
  Bottom 0.406: 32.86,31.75 | 32.86,31.75 v36.67,31.75 | POT4.2 26.51,30 28.26,31.75 32.86,31.75
ANA4
  Top 0.406: JP5.2 | JP5.2 40.48,45.72 40.48,29.05 20.32,8.89 X9.1 | JP5.2 | JP5.2 40.48,48.26 40.48,57.15 41.75,58.42 41.75,59.69 41.91,59.85 R34.2 | R34.2
ANA5
  Top 0.406: X9.2 | X9.2 43.02,26.67 43.02,45.72 JP4.2 | JP4.2 | JP4.2 | JP4.2 43.02,48.26 43.02,57.15 44.29,58.42 R40.2
ANA6
  Top 0.406: X9.3 30.32,10.16 45.56,25.4 45.56,45.72 JP3.2 | JP3.2 | JP3.2 | JP3.2 45.56,48.26 45.56,57.15 46.83,58.42 46.83,59.85 | 46.83,59.85 | 46.83,59.85 R2.2
ANA7
  Top 0.406: X9.4 35.4,12.7 46.83,24.13 46.83,35.56 48.1,36.83 48.1,45.72 JP2.2 | JP2.2 | JP2.2 | JP2.2 48.1,48.26 48.1,57.15 49.37,58.42 49.37,59.85 49.53,60.01 | 49.53,60.01 | 49.53,60.01 R3.2
BKGD  (via drill 0.61)
  Top 0.254: IC1.56 86.59,93.73 88.58,95.73 v89.06,95.73
  Top 0.406: R9.1 100.17,134.62 98.9,133.35 90.01,133.35 | 90.01,133.35 JP1.1 | v88.74,104.14 88.74,132.08 90.01,133.35
  Bottom 0.406: v89.06,95.73 89.06,100.01 88.74,100.33 v88.74,104.14
CS_SD  (via drill 0.61)
  Top 0.254: IC1.17 51.97,97.73 v50.64,99.06
  Top 0.406: v50.64,115.57 R17.2 | v50.64,115.57
  Bottom 0.406: v50.64,99.06 v50.64,115.57
D0  (via drill 0.61)
  Top 0.254: v41.75,90.49 42.7,90.49 43.02,90.17 53.18,90.17 56.24,93.23 IC1.26
  Bottom 0.406: X10.7 41.75,90.17 v41.75,90.49
D1  (via drill 0.61)
  Top 0.254: v39.21,89.85 40.16,89.85 40.48,89.53 53.82,89.53 57.01,92.73 IC1.27
  Bottom 0.406: X10.8 39.21,89.53 v39.21,89.85
D2  (via drill 0.61)
  Top 0.254: v36.67,89.22 37.62,89.22 37.94,88.9 54.45,88.9 57.78,92.23 IC1.28
  Bottom 0.406: X10.9 36.67,88.9 v36.67,89.22
D3  (via drill 0.61)
  Top 0.254: v34.13,88.58 35.08,88.58 35.4,88.27 55.09,88.27 58.55,91.73 IC1.29
  Bottom 0.406: 34.13,88.27 v34.13,88.58 | X10.10 34.13,88.27 | 34.13,88.27
DATA1+
  Top 0.406: IC5.7 66.36,128.91 65.09,130.18 65.09,131.6 61.87,134.82 X1.2
DATA1-
  Top 0.406: X1.3 64.61,135.89 67.69,132.82 IC5.8
DET_SD  (via drill 0.61)
  Top 0.254: IC1.15 75.33,108.66 v73.5,110.49
  Top 0.406: SD1.DETECT 41.48,94.98 43.34,96.84 43.34,101.6 | v54.45,102.87 53.18,101.6 43.34,101.6 | 43.34,101.6 R21.1 | 43.34,101.6 | 43.34,101.6
  Bottom 0.406: v73.5,110.49 58.26,110.49 55.72,110.49 54.45,109.22 v54.45,102.87
GND  (via drill 0.61)
  Top 0.254: v37.94,110.49 | v37.94,110.49 37.73,110.28 | v37.94,102.87 37.85,102.78 | C5.2 v96.36,109.22 | C4.2 v96.36,94.61 | IC5.15 57.63,122.56 56.99,121.92 C50.2 | C50.2 | IC02.26 13.01,140.02 13.66,140.02 IC02.25 13.66,136.84 | 13.66,136.84 16.26,136.84 | 18.21,136.84 IC02.18 | 16.26,136.84 IC02.21 | 16.26,136.84 18.21,136.84 | 18.21,136.84 18.21,135.62 18.89,134.94 C8.1 22.7,134.3 | IC02.7 15.61,132.61 16.35,133.35 16.35,136.84 16.26,136.84 | C10.1 | 13.66,136.84 12.39,135.57 C10.1 | C9.1 22.7,133.83 22.7,134.3 | IC04.2 | IC1.21 72.55,95.73 v75.09,95.73 | 22.7,134.3 v25.24,134.3 | C10.1 8.26,135.57 6.83,134.14 6.83,122.56 6.85,122.58 SD1.CASE2 | IC1.59 83.32,95.23 82.87,94.77 82.87,93.98 82.87,93.5 83.14,93.23 IC1.55 87.36,93.23 v87.79,93.66 | v94.14,94.46 | v94.14,94.46 93.5,93.82 C2.1 | IC1.45 80.83,89.09 81.12,89.38 82.71,89.38 82.87,89.22 83.82,88.27 v87.79,88.27 | 77.15,92.39 | 23.81,97.79
  Top 0.406: v56.99,15.24 LD10.K | v92.55,15.24 LD3.K | v92.55,15.24 | v87.47,15.24 LD4.K | v82.39,15.24 LD5.K | v62.07,15.24 LD9.K | v67.15,15.24 LD8.K | v72.23,15.24 LD7.K | v77.31,15.24 LD6.K | 51.91,9.05 | 51.91,9.05 X8.2 | v31.59,67.31 C22.1 | v31.59,67.31 | v34.13,67.31 C21.1 | v34.13,67.31 | v39.21,67.31 39.21,67.15 | 39.21,67.15 C18.1 | 39.21,67.15 | v41.75,67.31 C14.1 | v44.29,67.31 C13.1 | v46.83,67.31 C6.1 | v49.37,67.31 49.37,67.15 | 49.37,67.15 C7.1 | 49.37,67.15 | v41.75,38.1 R88.1 | v44.29,38.1 R87.1 | v44.29,38.1 | v46.83,38.1 R86.1 | v49.37,38.1 R85.1 | v49.37,38.1 | v60.8,38.1 R66.1 | v63.34,38.1 R65.1 | v63.34,38.1 | v65.88,38.1 R64.1 | v68.42,38.1 R63.1 | v70.96,38.1 R62.1 | v73.5,38.1 R61.1 | v36.67,67.31 C19.1 | v36.67,67.31 | v37.94,113.03 R19.1 | 64.77,84.61 64.77,84.14 64.77,80.96 61.91,78.11 60.8,78.11 T9.1 | T9.1 | 56.99,84.61 | 56.99,84.61 | v78.58,38.1 R59.1 | v76.04,38.1 R60.1 | v86.2,38.1 LD18.K | v86.2,38.1 | v103.98,38.1 LD11.K | v88.74,38.1 LD17.K | v88.74,38.1 | v96.36,38.1 LD14.K | v98.9,38.1 LD13.K | v101.44,38.1 LD12.K | SD1.COM 22.77,94.05 | 6.87,94.57 SD1.CASE1 | 59.53,111.76 | v76.04,92.71 76.83,92.71 77.15,92.39 | 77.15,92.39 77.31,92.23 80.64,92.23 82.39,93.98 82.87,93.98 | 59.53,111.76 | 59.53,111.76 | IC04.1 59.53,109.86 | 91.28,39.53 | 91.28,39.53 LD16.K | v91.28,38.1 91.28,39.53 | LD15.K 93.82,39.53 v93.82,38.1 | v51.91,15.24 51.91,15.72 | X3.2 | X3.2 15.06,8.91 | D1.A 15.06,18.12 | 23.97,21.59 POT4.1 | 7.46,39.33 POT1.1 | C12.1 | 10.32,65.41 X4.1 | 14.76,72.07 | C12.1 14.76,72.07 | X10.5 | 8.73,92.71 | R20.1 | v37.94,115.57 | 37.94,121.28
  Top 0.61: v37.94,110.49 R18.1 | 37.73,110.28 SD1.3 | 37.85,102.78 SD1.6 | IC5.15 63.98,122.56 64.61,123.19 64.61,127 v65.25,127.64 | 58.26,108.58 IC04.2 IC04.7 71.6,108.58 73.18,107 v73.18,99.38 | 58.26,108.58 58.26,109.86 IC04.1 | 58.26,107.31 IC04.3 | 58.26,108.58 58.26,107.31 | IC04.4 58.26,106.05 58.26,107.31 | 59.53,109.86 59.53,111.76
  Top 0.813: SD1.6 28.8,102.78 23.81,97.79 22.77,96.75 SD1.COM | 56.99,84.61 56.04,84.61 48.26,84.61 46.83,83.19 X10.5 v46.83,67.31 | 56.99,84.61 64.77,84.61 73.82,84.61 v74.3,85.09 | 56.99,84.61 X10.1 | v51.91,38.1 v51.91,67.31 | v76.68,127.64 C43.1 v73.18,131.44 73.18,132.4 70.1,135.48 X1.5 | JP1.2 87.47,138.43 81.12,132.08 v81.12,131.44 81.12,118.11 83.34,115.89 C3.1 | 22.77,94.05 21.43,92.71 8.73,92.71 | 8.73,92.71 6.87,94.57 | 8.73,92.71 R89.3 | C1.2 59.53,111.76 56.99,114.3 C50.2 37.94,121.28 | v40.48,133.35 37.94,130.81 37.94,121.28 | R20.1 v37.94,115.57 37.94,121.28 | 15.06,18.12 14.13,19.05 8.73,19.05 7.5,20.28 POT3.1 | D1.A 15.06,18.07 16.03,19.05 23.02,19.05 23.97,20 23.97,21.59 | POT2.1 20.68,36.04 9.05,36.04 7.46,37.62 7.46,39.33 | IC06.1 18.74,68.26 v16.51,70.48 C12.1 | 10.32,65.41 14.76,69.85 14.76,72.07 | X4.1 10.32,62.23 X4.3 | C11.1 27.62,62.39 v28.73,63.5
  Top 1.778: v51.91,15.24 51.91,9.05 | 51.91,15.72 50.64,16.99 D2.A | 15.06,8.91 D1.A
  Bottom 0.406: v101.44,38.1 101.6,38.1 101.44,37.94 | 90.17,94.77 88.9,94.77 v87.79,93.66 87.79,92.08 v87.79,88.27 | POT4.1 23.97,21.63 | 24.01,38.3 23.97,38.26 24.13,38.1 | v86.2,38.1 | v51.91,67.31
  Bottom 0.813: v51.91,15.24 v56.99,15.24 v62.07,15.24 v67.15,15.24 v72.23,15.24 v77.31,15.24 v82.39,15.24 v87.47,15.24 v92.55,15.24 98.9,15.24 101.44,17.78 101.44,37.94 | v37.94,115.57 v37.94,113.03 v37.94,110.49 v37.94,102.87 | v101.44,38.1 v98.9,38.1 v96.36,38.1 v93.82,38.1 v91.28,38.1 v88.74,38.1 v86.2,38.1 v78.58,38.1 v76.04,38.1 v73.5,38.1 v70.96,38.1 v68.42,38.1 v65.88,38.1 v63.34,38.1 v60.8,38.1 v51.91,38.1 v49.37,38.1 v46.83,38.1 v44.29,38.1 v41.75,38.1 24.13,38.1 | 101.6,38.1 v103.98,38.1 | v65.25,127.64 v76.68,127.64 | v73.18,99.38 75.09,97.47 v75.09,95.73 75.09,93.66 v76.04,92.71 74.3,90.96 v74.3,85.09 | v73.18,131.44 v81.12,131.44 | v51.91,67.31 v49.37,67.31 v46.83,67.31 v44.29,67.31 v41.75,67.31 v39.21,67.31 v36.67,67.31 v34.13,67.31 v31.59,67.31 28.73,67.31 | 24.01,38.3 POT2.1 | 23.97,21.63 23.97,38.26 | 28.73,67.31 v28.73,63.5 | 28.73,67.31 28.73,71.91 27.3,73.34 19.37,73.34 v16.51,70.48
  pour Bottom: 90.01,110.49 90.01,93.98 103.98,93.98 103.98,110.49
  pour Bottom: 22.7,148.59 45.56,148.59 45.56,133.19 22.7,133.19
IRQ  (via drill 0.61)
  Top 0.254: R6.1 79.53,107 v79.85,106.68 | IC1.2 81.83,102.31 82.39,102.87 v82.39,106.68
  Bottom 0.406: v82.39,106.68 v79.85,106.68
LCD_LED  (via drill 0.61)
  Top 0.254: IC1.49 83.44,90.23 82.55,91.12 v78.11,91.12 | v78.11,91.12
  Top 0.406: v72.23,78.74 65.88,78.74 62.07,74.93 R84.2 | R84.2
  Bottom 0.254: v78.11,91.12 78.11,83.34 73.5,78.74 v72.23,78.74
MISO  (via drill 0.61)
  Top 0.254: IC1.18 50.57,97.23 v49.37,98.42
  Top 0.406: v49.37,107.95 R14.2 | v49.37,107.95
  Bottom 0.406: v49.37,98.42 v49.37,107.95
MOSI  (via drill 0.61)
  Top 0.254: IC1.19 49.16,96.73 v48.1,97.79
  Top 0.406: R15.2 46.83,113.03 v48.1,111.76
  Bottom 0.406: v48.1,97.79 v48.1,111.76
N$1
  Top 0.254: SD1.2 36.6,112.78 | 41.43,112.55 R19.2 R15.1 | R15.1 | R15.1
  Top 0.406: 36.6,112.78 37.62,111.76 40.64,111.76 41.43,112.55
N$2
  Top 0.254: 13.81,144.62 | R10.2 13.81,144.62 | 13.81,144.62 LD1.K | 13.81,144.62
N$3  (via drill 0.61)
  Top 0.254: SD1.7 35.17,100.33 | 43.02,107.95 R14.1
  Top 0.406: 35.17,100.33 v41.75,100.33 | v41.75,106.68 43.02,107.95
  Bottom 0.406: v41.75,100.33 v41.75,106.68
N$4  (via drill 0.61)
  Top 0.254: IC1.42 79.33,71.64 83.66,67.31 v90.01,67.31 | v103.98,67.31 R54.1 | v103.98,67.31
  Bottom 0.254: v90.01,67.31 v103.98,67.31
N$5
  Top 0.254: IC02.23 14.96,139.82 13.81,140.97 R10.1 | R10.1 | R10.1
N$6
  Top 0.254: R11.2 | R11.2 LD2.K | R11.2
N$7
  Top 0.254: IC02.22 15.61,140.71 16.35,141.45 R11.1
N$8  (via drill 0.61)
  Top 0.254: IC1.43 79.83,72.41 83.66,68.58 v90.01,68.58 | v101.44,68.58 R90.1
  Bottom 0.254: v90.01,68.58 v101.44,68.58
N$9  (via drill 0.61)
  Top 0.254: IC1.46 81.33,72.18 83.66,69.85 v90.01,69.85 | R91.1 v98.9,69.85
  Bottom 0.254: v98.9,69.85 v90.01,69.85
N$10  (via drill 0.61)
  Top 0.254: IC1.47 81.83,72.95 83.66,71.12 v90.01,71.12 | R92.1 | R92.1 v96.36,71.12
  Bottom 0.254: v96.36,71.12 v90.01,71.12
N$11
  Top 0.406: JP13.3 R58.1
N$12
  Top 0.406: JP12.3 | JP12.3 | R57.1 | JP12.3 R57.1
N$13  (via drill 0.61)
  Top 0.406: R69.2 64.61,19.05 63.34,20.32 63.34,22.86 64.29,23.81 | 64.29,23.81 R43.2 | 64.29,23.97 | 64.29,23.81 64.29,23.97 | 64.29,23.97 64.45,23.97 R43.2 64.61,25.4 62.78,27.23 T3.B2 v62.35,29.33 | JP11.2 | JP11.2 64.61,45.72 64.61,37.47 63.98,36.83 v63.98,30.96
  Bottom 0.406: v62.35,29.33 v63.98,30.96
N$14
  Top 0.406: LD11.A R75.2
N$15
  Top 0.406: R76.2 101.44,44.61 LD12.A
N$16
  Top 0.254: C4.1 | C4.1 R1.2 | Q1.2 98.81,96.77 98.11,97.47 96.2,97.47 | 96.2,97.47 C4.1 | 89.22,97.31 | 89.22,97.31 89.38,97.47 96.2,97.47 | IC1.57 86.13,94.23 89.22,97.31
N$17
  Top 0.254: IC1.50 97.07,90.73 97.63,90.17 | 97.63,90.17 | 97.63,90.17 97.63,76.2 93.82,72.39 R93.1
N$18  (via drill 0.61)
  Top 0.254: v98.9,74.93 98.9,90.65 98.32,91.23 IC1.51 | R94.1 v91.28,74.93
  Bottom 0.406: v91.28,74.93 v98.9,74.93
N$19  (via drill 0.61)
  Top 0.254: IC1.52 98.93,91.73 100.17,90.49 v100.17,59.69 | R95.1 88.74,58.42 v90.01,59.69
  Bottom 0.254: v90.01,59.69 v100.17,59.69
N$20  (via drill 0.61)
  Top 0.254: IC1.53 99.38,92.23 100.17,91.44 | 100.17,91.44 | 100.17,91.44 100.97,90.65 100.97,72.87 102.71,71.12 v102.71,60.96 | R96.1 v86.2,60.96
  Bottom 0.254: v86.2,60.96 v102.71,60.96
N$21  (via drill 0.61)
  Top 0.254: IC1.12 76.83,94.46 v77.95,93.34
  Top 0.406: R48.1 85.25,21.91 87.15,23.81 R28.1 87.47,24.13 89.22,25.88 89.22,28.57 88.74,29.05 | 88.74,29.05 | 88.74,29.05 84.45,33.34 84.45,36.04 83.03,37.47 83.03,55.24 83.66,55.88 83.66,59.69 82.39,60.96 v78.58,60.96
  Bottom 0.254: v77.95,93.34 79.22,92.08 79.22,66.67 78.58,66.04 v78.58,60.96
N$22
  Top 0.254: IC1.58 85.84,94.73 89.22,98.11 89.22,101.76 89.85,102.39 R1.1 C5.1 | Q1.1 98.33,106.43 97.63,105.73 C5.1 | C5.1
N$23  (via drill 0.61)
  Top 0.254: IC1.11 77.33,95.23 v79.22,93.34
  Top 0.406: R46.1 80.17,21.91 82.07,23.81 R29.1 82.39,25.4 83.66,26.67 83.66,35.56 82.39,36.83 82.39,55.88 82.87,56.36 82.87,58.42 82.39,58.9 | 82.39,58.9 | 82.39,58.9 82.07,59.21 81.6,59.69 v79.85,59.69
  Bottom 0.254: v79.22,93.34 79.85,92.71 v79.85,59.69
N$24
  Top 0.406: R27.2 | LD3.A R27.2 | R27.2
N$25
  Top 0.406: 87.47,21.75 | 87.47,21.75 R28.2 | LD4.A 87.47,21.75
N$26
  Top 0.406: LD5.A R29.2
N$27
  Top 0.406: 77.31,21.75 | 77.31,21.75 R35.2 | LD6.A 77.31,21.75
N$28
  Top 0.254: R16.1 | R18.2 R16.1 | R16.1
  Top 0.406: SD1.5 38.13,105.28 41.43,108.58 R18.2
N$29
  Top 0.406: 72.23,21.75 | 72.23,21.75 R36.2 | LD7.A 72.23,21.75
N$30
  Top 0.254: SD1.1 36.64,115.28 | 41.43,115.09 R20.2 R17.1 | R17.1 | R17.1
  Top 0.406: 36.64,115.28 37.62,114.3 40.64,114.3 41.43,115.09
N$31
  Top 0.406: LD8.A R37.2
N$32
  Top 0.406: LD9.A R38.2
N$33
  Top 0.406: LD10.A R39.2
N$34
  Top 0.406: JP11.3 R56.1
N$35
  Top 0.406: R71.2 74.77,19.05 73.5,20.32 73.5,22.86 74.45,23.81 | 74.45,23.81 | 74.45,23.81 R45.2 74.93,25.4 75.05,25.52 T5.B2 75.05,28.3 74.77,28.57 72.23,28.57 70.96,29.84 70.96,35.56 69.69,36.83 69.69,45.72 JP9.2 | JP9.2
N$36  (via drill 0.61)
  Top 0.406: R72.2 79.85,19.05 78.58,20.32 78.58,22.86 79.53,23.81 R46.2 79.85,24.77 81.4,26.31 T6.B2 | JP8.2 | JP8.2 72.23,45.72 72.23,36.04 71.75,35.56 71.75,30.8 73.18,29.37 v75.72,29.37
  Bottom 0.406: v75.72,29.37 80.96,29.37 81.4,28.93 T6.B2
N$37  (via drill 0.61)
  Top 0.406: R73.2 84.93,19.05 83.66,20.32 83.66,22.86 84.61,23.81 R48.2 84.93,24.29 87.75,27.11 T7.B2 | JP7.2 | JP7.2 74.77,45.72 74.77,35.88 76.2,34.45 v76.2,32.23
  Bottom 0.406: v76.2,32.23 87,32.23 87.47,31.75 87.75,31.47 T7.B2
N$38
  Top 0.406: JP10.3 | JP10.3 R55.1
N$39
  Top 0.406: JP9.3 | JP9.3 R53.1
N$40
  Top 0.406: JP8.3 | JP8.3 R52.1
N$41
  Top 0.406: JP7.3 | JP7.3 R51.1
N$42  (via drill 0.61)
  Top 0.254: IC1.10 77.83,96 v79.22,94.61
  Top 0.406: R49.1 90.33,21.91 92.23,23.81 R27.1 92.55,24.61 90.96,26.19 90.96,34.13 88.27,36.83 84.93,36.83 83.66,38.1 83.66,54.61 84.93,55.88 84.93,56.67 84.93,60.96 83.66,62.23 v81.12,62.23
  Bottom 0.254: v79.22,94.61 80.49,93.34 80.49,62.87 v81.12,62.23
N$43
  Top 0.406: X8.1 46.99,8.89
  Top 1.27: R5.1 X8.1
N$44  (via drill 0.61)
  Top 0.254: v81.92,98.27 81.6,98.27 | 81.6,98.27 | 81.6,98.27 81.44,98.27 80.83,98.87 IC1.4
  Top 0.406: R41.1 54.77,21.91 56.67,23.81 R39.1 56.99,25.4 54.29,25.4 52.39,27.3 52.39,36.67 53.02,37.31 | 53.02,37.31 | 53.02,37.31 53.18,37.47 53.18,52.07 55.72,54.61 55.72,62.23 59.53,66.04 v86.2,66.04
  Bottom 0.254: v81.92,98.27 83.66,96.52 83.66,69.85 86.2,67.31 v86.2,66.04
N$45  (via drill 0.61)
  Top 0.254: IC1.5 80.33,98.58 v81.92,97
  Top 0.406: R42.1 59.85,21.91 61.75,23.81 R38.1 62.07,25.4 59.85,25.4 58.26,26.99 58.26,29.21 56.99,30.48 53.82,30.48 53.02,31.27 53.02,36.2 54.45,37.62 54.45,52.07 56.99,54.61 56.99,62.23 59.53,64.77 v84.93,64.77
  Bottom 0.254: v81.92,97 83.03,95.89 83.03,68.58 83.66,67.94 | v84.93,64.77 84.93,66.67 83.66,67.94 | 83.66,67.94
N$46  (via drill 0.61)
  Top 0.254: IC1.6 79.83,97.81 v80.49,97.16
  Top 0.406: R43.1 64.93,21.91 66.83,23.81 R37.1 67.15,24.77 63.98,27.94 63.98,29.37 62.55,30.8 58.42,30.8 57.47,31.75 57.47,34.13 55.72,35.88 55.72,52.07 58.26,54.61 58.26,62.23 59.53,63.5 v83.66,63.5
  Bottom 0.254: v80.49,97.16 82.39,95.25 82.39,67.31 83.66,66.04 v83.66,63.5
N$47  (via drill 0.61)
  Top 0.254: IC1.7 79.33,97.04 v80.49,95.89
  Top 0.406: R44.1 70.01,21.91 71.91,23.81 R36.1 72.23,25.4 | 72.23,25.4 | 72.23,25.4 72.23,26.04 71.44,26.83 v71.44,27.62 | v82.71,30.96 82.71,34.92 81.76,35.88 v81.76,57.78
  Bottom 0.254: v80.49,95.89 81.76,94.61 81.76,63.98 83.66,62.07 83.66,59.69 v81.76,57.78
  Bottom 0.406: v71.44,27.62 71.44,28.1 73.98,30.64 82.39,30.64 v82.71,30.96
N$48  (via drill 0.61)
  Top 0.254: IC1.8 78.83,96.27 v80.49,94.61
  Top 0.406: R45.1 75.09,21.91 76.99,23.81 R35.1 77.31,25.4 | 77.31,25.4 | 77.31,25.4 77.31,27.94 77.95,28.57 77.95,35.88 81.12,39.05 81.12,55.88 | 81.12,55.88 | 81.12,55.88 v80.49,56.52
  Bottom 0.254: v80.49,94.61 81.12,93.98 81.12,63.66 82.39,62.39 82.39,60.33 80.49,58.42 v80.49,56.52
N$49  (via drill 0.61)
  Top 0.254: v31.59,87.95 32.54,87.95 32.86,87.63 55.72,87.63 59.32,91.23 IC1.30
  Bottom 0.406: X10.11 31.59,87.63 v31.59,87.95
N$50  (via drill 0.61)
  Top 0.254: v29.05,87.31 30,87.31 30.32,87 56.36,87 56.52,87.15 | IC1.31 60.09,90.73 56.52,87.15 | 56.52,87.15
  Bottom 0.406: X10.12 29.05,87 v29.05,87.31
N$51  (via drill 0.61)
  Top 0.254: v26.51,86.68 27.46,86.68 27.78,86.36 56.99,86.36 60.86,90.23 IC1.32
  Bottom 0.406: X10.13 26.51,86.36 v26.51,86.68
N$52  (via drill 0.61)
  Top 0.254: IC1.33 74.83,87.37 73.18,85.72 v23.97,85.72
  Bottom 0.406: X10.14 v23.97,85.72 | v23.97,85.72
N$53
  Top 0.406: R4.1
  Top 1.27: R4.1 X3.1
N$54  (via drill 0.61)
  Top 0.406: R67.2 54.45,19.05 53.18,20.32 53.18,22.86 54.13,23.81 | R41.2 54.13,23.81 | 54.13,23.81 54.29,23.81 54.45,23.97 54.45,24.13 51.35,27.23 T1.B2 49.65,29.33 51.28,30.96 51.28,36.04 v51.28,36.83 | JP13.2 | JP13.2 59.53,45.72 59.53,38.1 v58.26,36.83
  Bottom 0.406: v51.28,36.83 v58.26,36.83
N$55  (via drill 0.61)
  Top 0.254: v44.29,91.44 44.93,92.08 52.55,92.08 | 52.55,92.08 | IC1.23 55.2,94.73 52.55,92.08
  Bottom 0.406: X10.6 v44.29,91.44 | v44.29,91.44
N$56  (via drill 0.61)
  Top 0.406: R68.2 59.53,19.05 58.26,20.32 58.26,22.86 59.21,23.81 | 59.21,23.81 R42.2 | 59.21,23.81 59.37,23.81 59.53,23.97 59.53,24.45 56.75,27.23 T2.B2 56,29.33 v56.04,29.37 | JP12.2 62.07,45.72 62.07,37.62 61.28,36.83 60.48,36.83 59.21,35.56 v59.21,32.54 | v59.21,32.54 | v56.04,29.37
  Bottom 0.406: v56.04,29.37 v59.21,32.54
N$57
  Top 0.406: JP6.3 | JP6.3 R50.1
N$58  (via drill 0.61)
  Top 0.254: IC1.24 55.97,94.23 52.86,91.12 v49.37,91.12 | v49.37,91.12
  Bottom 0.406: v49.37,91.12 | X10.4 v49.37,91.12
N$59
  Top 0.406: R70.2 69.69,19.05 68.42,20.32 68.42,22.86 69.37,23.81 | 69.37,23.81 | R44.2 | 69.37,23.81 R44.2 | R44.2 69.69,25.56 68.7,26.55 T4.B2 68.7,27.66 65.25,31.11 65.25,35.56 67.15,37.47 67.15,45.72 JP10.2 | JP10.2
N$60
  Bottom 0.406: X10.3 51.91,81.28 50.64,80.01 12.54,80.01 10,77.47 R89.2 | R89.2
N$61
  Top 0.406: JP6.1 | R59.2 JP6.1
N$62
  Top 0.406: R60.2 JP7.1
N$63
  Top 0.406: R61.2 JP8.1
N$64
  Top 0.406: R62.2 JP9.1
N$65  (via drill 0.61)
  Top 0.254: 94.14,27.3 94.1,27.27 T8.B2
  Top 0.406: R74.2 90.01,19.05 88.74,20.32 88.74,22.86 89.69,23.81 | 89.69,23.81 | 89.69,23.81 R49.2 v90.01,29.21 | JP6.2 | JP6.2 77.31,45.72 v77.31,36.83 | v93.5,29.21 94.14,28.57 | 94.14,28.57 94.14,27.3 | v95.09,36.83 96.36,35.56 96.36,30.8 94.14,28.57
  Bottom 0.254: v90.01,29.21 91.28,29.21
  Bottom 0.406: 91.28,29.21 v93.5,29.21 | v95.09,36.83 v77.31,36.83
N$66
  Top 0.406: R63.2 JP10.1
N$67
  Top 0.406: R64.2 JP11.1
N$68
  Top 0.406: JP12.1 | R65.2 JP12.1
N$69
  Top 0.406: R66.2 JP13.1
N$70
  Top 0.406: 25.08,68.1 25.07,68.12 IC06.3
  Top 0.61: 25.08,68.1 25.08,66.52 26.51,65.09 C11.2 24.61,64.29 24.45,64.14 D3.K
N$71
  Top 0.61: X4.2 16.03,62.07 19.05,59.05 D3.A
N$72
  Top 0.406: LD13.A R77.2
N$73
  Top 0.406: R78.2 | LD14.A R78.2
N$74
  Top 0.406: R79.2 LD15.A | R79.2
N$75
  Top 0.406: R80.2 | LD16.A R80.2 | R80.2
N$76
  Top 0.406: R81.2 88.74,44.61 LD17.A
N$77
  Top 0.406: R82.2 | LD18.A R82.2
N$86  (via drill 0.61)
  Top 0.406: R83.1 v56.36,80.64 | v56.36,80.64
  Bottom 0.406: X10.15 62.07,82.07 60.64,80.64 v56.36,80.64
N$87
  Top 0.406: T9.3 | X10.16 T9.3
N$88
  Top 0.406: T9.2 | R84.1 T9.2 | T9.2
N$89
  Top 0.406: JP5.3 R26.1
N$90
  Top 0.254: IC5.1 72.39,121.28 73.18,122.08 C42.1 | C42.1
N$91
  Top 0.254: IC5.3 69.53,123.83 70.64,122.71 C42.2 | C42.2
N$92
  Top 0.254: 71.12,125.09 C45.2 | IC5.4 71.12,125.09 | 71.12,125.09
N$93
  Top 0.254: IC5.5 72.55,126.36 73.18,125.73 C45.1
N$94
  Top 0.254: IC5.2 66.2,122.56 65.56,121.92 65.56,119.54 | 65.56,119.54 | C44.1 65.56,119.54
N$95
  Top 0.254: IC5.6 C43.2 | C43.2
N$96
  Top 0.406: R25.1 44.45,52.55 | R25.1 | JP4.3 R25.1 | R25.1
N$97
  Top 0.406: JP3.3 R24.1
N$98
  Top 0.406: 49.37,52.55 R23.1 JP2.3
N$99
  Top 0.406: 49.37,41.75 | R85.2 49.37,41.75 | 49.37,41.75 JP2.1
N$100
  Top 0.406: R86.2 JP3.1
N$101
  Top 0.406: 44.29,41.75 | R87.2 44.29,41.75 | 44.29,41.75 JP4.1
N$102
  Top 0.406: R88.2 | R88.2 JP5.1 | R88.2 41.59,41.43
PD0
  Top 0.406: R75.1 JP14.8 R54.2 | R54.2
PD1
  Top 0.406: R90.2 JP14.7 R76.1
PD2
  Top 0.406: R77.1 JP14.6 R91.2
PD3
  Top 0.406: R78.1 | R92.2 | R92.2 JP14.5 R78.1
PD4
  Top 0.406: R93.2 | R93.2 | R93.2 JP14.4 R79.1 | R79.1
PD5
  Top 0.406: R94.2 JP14.3 R80.1 | R80.1
PD6
  Top 0.406: R81.1 JP14.2 R95.2
PD7
  Top 0.406: R82.1 | R96.2 | R82.1 JP14.1 R96.2 | R96.2
PF0
  Top 0.406: X6.1 56.99,12.7 54.45,15.24 54.45,16.51 54.29,16.67 R67.1
PF1
  Top 0.406: X6.2 62.07,12.7 59.53,15.24 R68.1 | R68.1 | R68.1
PF2
  Top 0.406: X6.3 67.15,12.7 64.61,15.24 R69.1 | R69.1
PF3
  Top 0.406: X6.4 72.23,12.7 69.69,15.24 R70.1 | R70.1 | R70.1
PF4
  Top 0.406: X7.1 77.31,12.7 74.77,15.24 R71.1
PF5
  Top 0.406: X7.2 82.39,12.7 79.85,15.24 R72.1 | R72.1
PF6
  Top 0.406: X7.3 87.47,12.7 84.93,15.24 R73.1 84.93,16.99
PF7
  Top 0.406: X7.4 92.55,12.7 90.01,15.24 R74.1 | R74.1
PROT_SD  (via drill 0.61)
  Top 0.254: R22.1 42.39,105.41 41.12,104.14 15.08,104.14 11.17,100.23 SD1.PROTECT | IC1.16 74.83,107.89 73.66,109.06 v73.5,109.22
  Top 0.406: R22.1 43.34,105.73 44.29,106.68 v55.72,106.68
  Bottom 0.406: v55.72,106.68 58.26,109.22 v73.5,109.22
RESET
  Top 0.254: 80.49,114.3 C3.2 | 80.49,114.3 R13.1 79.53,132.24 87,139.7 91.28,139.7 JP1.4 | JP1.4 | IC1.3 81.33,112.19 80.49,113.03 80.49,114.3
RX1  (via drill 0.61)
  Top 0.254: IC1.14 75.83,109.91 75.41,110.33 75.41,115.41 75.41,116.2 v74.77,116.84 | v21.43,118.11 21.43,123.19 20.16,124.46 13.81,124.46 11.71,126.56 IC02.1
  Bottom 0.254: v21.43,118.11 22.7,116.84 v74.77,116.84
RX2  (via drill 0.61)
  Top 0.254: IC1.64 85.35,97.73 85.88,98.27 85.88,100.65 84.93,101.6 84.93,128.91 v83.66,130.18 | v83.66,130.18
  Top 0.406: v63.66,130.18 IC5.9 | v63.66,130.18
  Bottom 0.406: v83.66,130.18 v63.66,130.18
SCL  (via drill 0.61)
  Top 0.254: IC1.60 85.89,95.73 87.95,97.79 87.95,103.82 87.63,104.14 v87.63,105.41
  Top 0.406: IC04.6 70.33,107.31 v70.96,106.68
  Bottom 0.406: v70.96,106.68 77.31,106.68 78.58,105.41 v87.63,105.41
SCL_SD  (via drill 0.61)
  Top 0.254: IC1.20 48.39,96.23 v46.83,97.79
  Top 0.406: v46.83,110.49 R16.2 | v46.83,110.49
  Bottom 0.406: v46.83,97.79 v46.83,110.49
SDA  (via drill 0.61)
  Top 0.254: IC1.61 85.59,96.23 87.31,97.95 87.31,103.35 v86.68,103.98
  Top 0.406: R47.1 64.29,105.09 65.25,106.05 IC04.5 v69.06,106.05
  Bottom 0.406: v86.68,103.98 71.12,103.98 v69.06,106.05
TX1  (via drill 0.61)
  Top 0.254: IC1.13 76.33,110.2 76.04,110.49 v76.04,118.11 | IC02.5 14.31,126.98 15.56,125.73 22.7,125.73 23.97,124.46 v23.97,118.11
  Bottom 0.254: v23.97,118.11 v76.04,118.11
TX2  (via drill 0.61)
  Top 0.254: IC1.63 85.64,97.23 86.52,98.11 86.52,100.97 85.72,101.76 85.72,108.74 86.52,109.54 v86.52,128.91 | v63.66,128.91 63.5,128.91 | 63.5,128.91
  Top 0.406: 63.5,128.91 IC5.10
  Bottom 0.406: v86.52,128.91 v63.66,128.91
USB_1
  Top 0.254: R12.1 | X2.1 35.42,130.51 R12.1
USB_2
  Top 0.254: IC02.16 19.51,144.13 22.7,147.32 37.94,147.32 39.21,146.05 39.21,135.89 38.48,135.16 X2.2
USB_3
  Top 0.254: X2.3 37.92,144.8 36.67,146.05 22.7,146.05 20.16,143.51 IC02.15

### Text on the board
Top: 8..12V= | DLN:18319
Bottom: DLN:18319
tPlace: SCI/USB: | SCI/RS232: | 1 | TX1/PE0 | TX2/PC3 | RX1/PE1 | RX2/PC5 | BDM-Module | SCL=PC0 | SCDAT=PC1 | PA[0..7]=Data LCD | PG0=E PG1=RS | PG4=Backlight | 8..12V= | PB0 | PB1 | Pull: | Up | PD7 | PD0 | Down | PB2 | PB3 | PF0 | PF1 | PF2 | PF3 | PF4 | PF5 | PF6 | PF7 | DLN:18319 | +5V | GND | PB4 | PB5 | PB6 | PB7 | +5V | GND | PF0 | PF1 | PF2 | PF3 | PF4 | PF5 | PF7 | PF6